# EAGLE design CCM_0011_Subrack_Backplane (EAGLE 8.6.0)

## Sheet 1 of 6: Bus Standard Definition
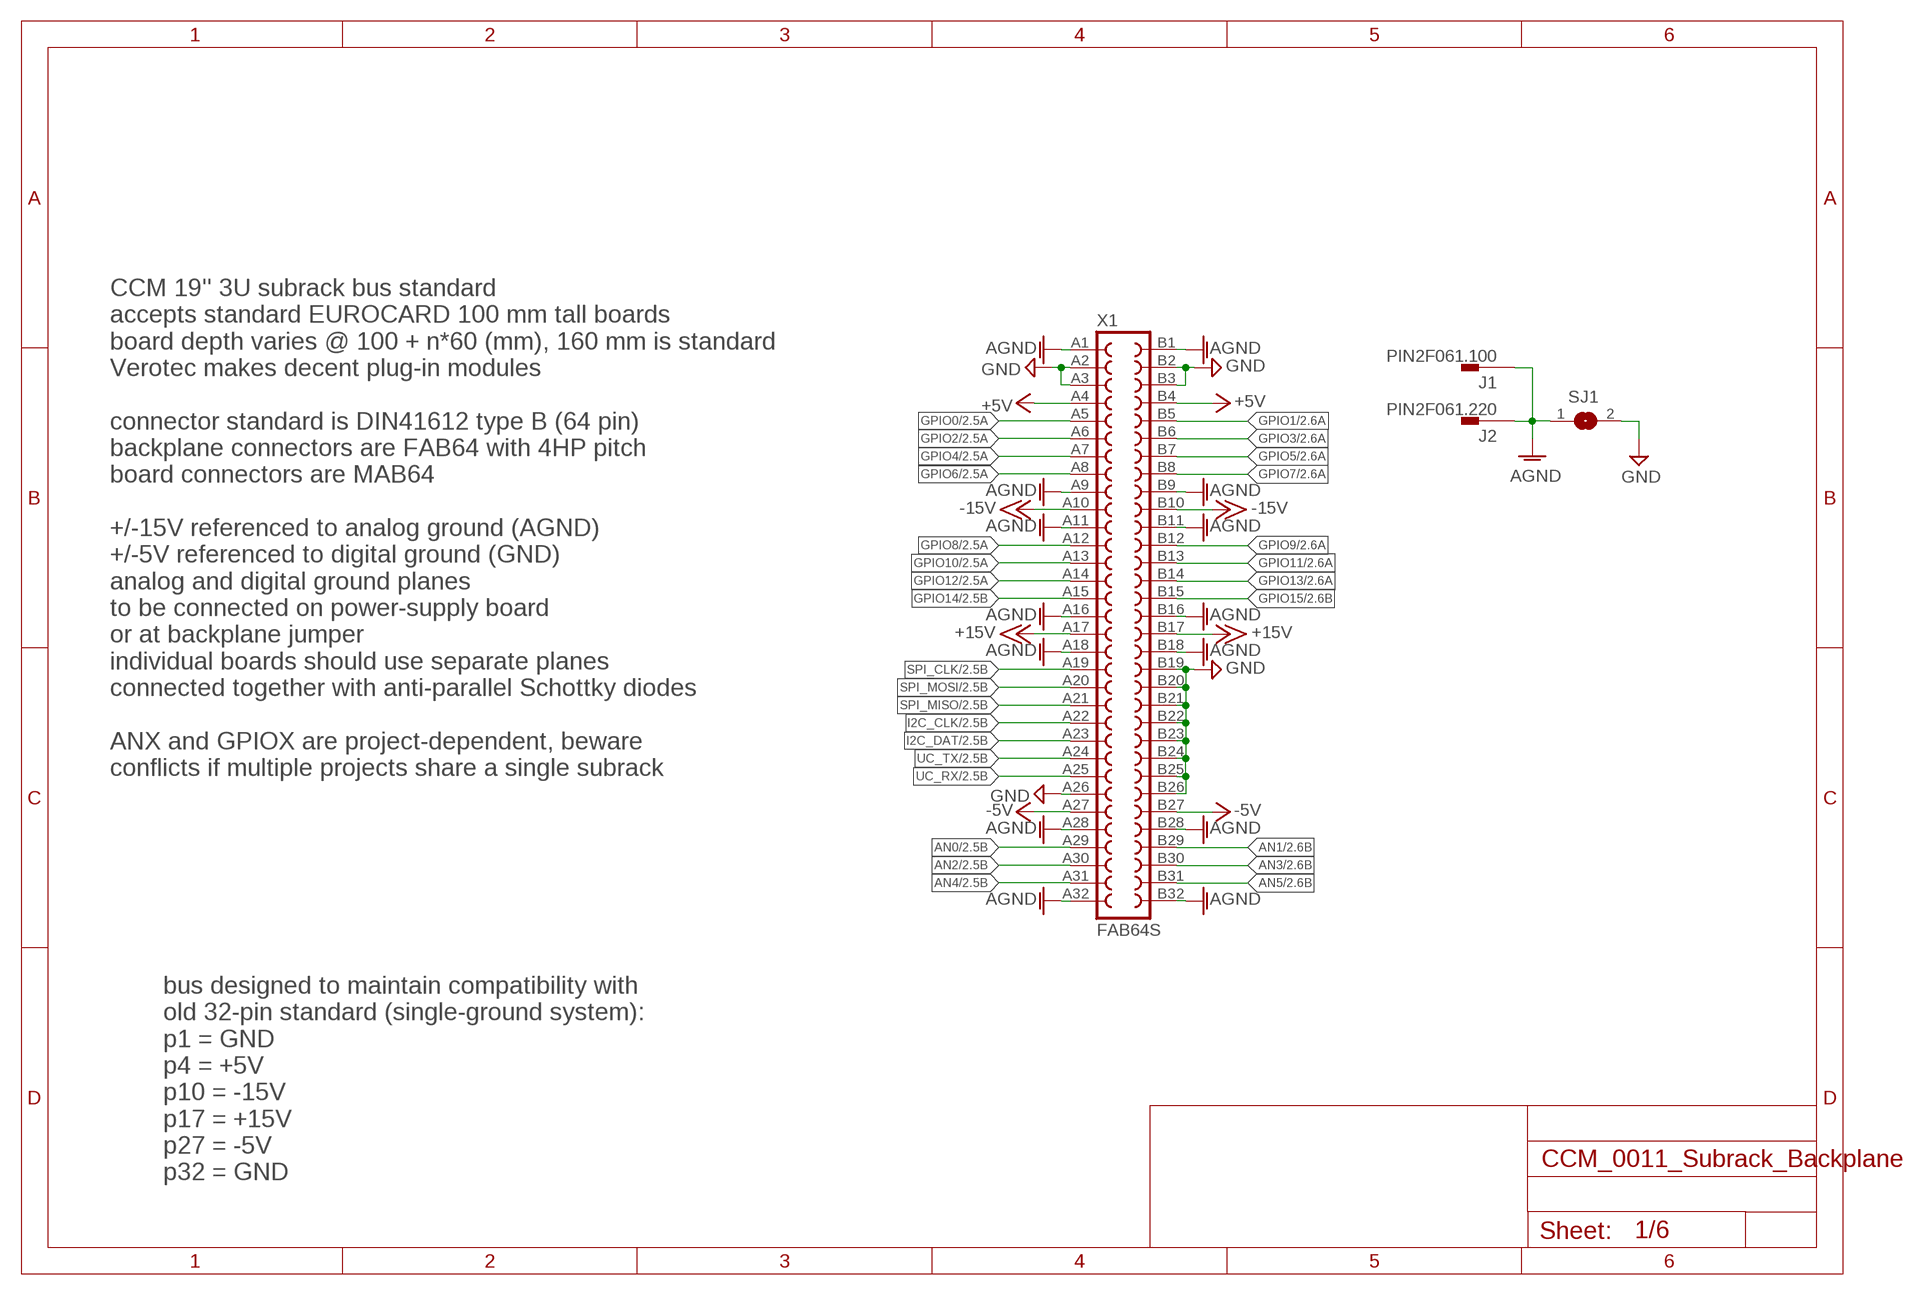
[diagram p0: schematic, sheet 1]

### Parts
J1  PIN2F061.100  [F061.100]
J2  PIN2F061.220  [F061.220]
SJ1  SJ  [SJ]
X1  FAB64S  [FAB64S]

### Nets
+5V: X1.A4 X1.B4 ; also sheet 2,3,4,5,6
+15V: X1.A17 X1.B17 ; also sheet 2,3,4,5,6
-5V: X1.A27 X1.B27 ; also sheet 2,3,4,5,6
-15V: X1.A10 X1.B10 ; also sheet 2,3,4,5,6
AGND: J1.A1 J1.A2 J2.1A J2.1B SJ1.1 X1.A1 X1.A9 X1.A11 X1.A16 X1.A18 X1.A28 X1.A32 X1.B1 X1.B9 X1.B11 X1.B16 X1.B18 X1.B28 X1.B32 ; also sheet 2,3,4,5,6
AN0: X1.A29 ; also sheet 2,3,4,5,6
AN1: X1.B29 ; also sheet 2,3,4,5,6
AN2: X1.A30 ; also sheet 2,3,4,5,6
AN3: X1.B30 ; also sheet 2,3,4,5,6
AN4: X1.A31 ; also sheet 2,3,4,5,6
AN5: X1.B31 ; also sheet 2,3,4,5,6
GND: SJ1.2 X1.A2 X1.A3 X1.A26 X1.B2 X1.B3 X1.B19 X1.B20 X1.B21 X1.B22 X1.B23 X1.B24 X1.B25 X1.B26 ; also sheet 2,3,4,5,6
GPIO0: X1.A5 ; also sheet 2,3,4,5,6
GPIO1: X1.B5 ; also sheet 2,3,4,5,6
GPIO2: X1.A6 ; also sheet 2,3,4,5,6
GPIO3: X1.B6 ; also sheet 2,3,4,5,6
GPIO4: X1.A7 ; also sheet 2,3,4,5,6
GPIO5: X1.B7 ; also sheet 2,3,4,5,6
GPIO6: X1.A8 ; also sheet 2,3,4,5,6
GPIO7: X1.B8 ; also sheet 2,3,4,5,6
GPIO8: X1.A12 ; also sheet 2,3,4,5,6
GPIO9: X1.B12 ; also sheet 2,3,4,5,6
GPIO10: X1.A13 ; also sheet 2,3,4,5,6
GPIO11: X1.B13 ; also sheet 2,3,4,5,6
GPIO12: X1.A14 ; also sheet 2,3,4,5,6
GPIO13: X1.B14 ; also sheet 2,3,4,5,6
GPIO14: X1.A15 ; also sheet 2,3,4,5,6
GPIO15: X1.B15 ; also sheet 2,3,4,5,6
I2C_CLK: X1.A22 ; also sheet 2,3,4,5,6
I2C_DAT: X1.A23 ; also sheet 2,3,4,5,6
SPI_CLK: X1.A19 ; also sheet 2,3,4,5,6
SPI_MISO: X1.A21 ; also sheet 2,3,4,5,6
SPI_MOSI: X1.A20 ; also sheet 2,3,4,5,6
UC_RX: X1.A25 ; also sheet 2,3,4,5,6
UC_TX: X1.A24 ; also sheet 2,3,4,5,6

### Notes on the sheet
- CCM 19'' 3U subrack bus standard
  accepts standard EUROCARD 100 mm tall boards
  board depth varies @ 100 + n*60 (mm), 160 mm is standard
  Verotec makes decent plug-in modules
  
  connector standard is DIN41612 type B (64 pin)
  backplane connectors are FAB64 with 4HP pitch 
  board connectors are MAB64
  
  +/-15V referenced to analog ground (AGND)
  +/-5V referenced to digital ground (GND)
  analog and digital ground planes
  to be connected on power-supply board
  or at backplane jumper
  individual boards should use separate planes
  connected together with anti-parallel Schottky diodes
  
  ANX and GPIOX are project-dependent, beware 
  conflicts if multiple projects share a single subrack
- bus designed to maintain compatibility with 
  old 32-pin standard (single-ground system):
  p1 = GND
  p4 = +5V
  p10 = -15V
  p17 = +15V
  p27 = -5V
  p32 = GND

## Sheet 2 of 6: backplane 1
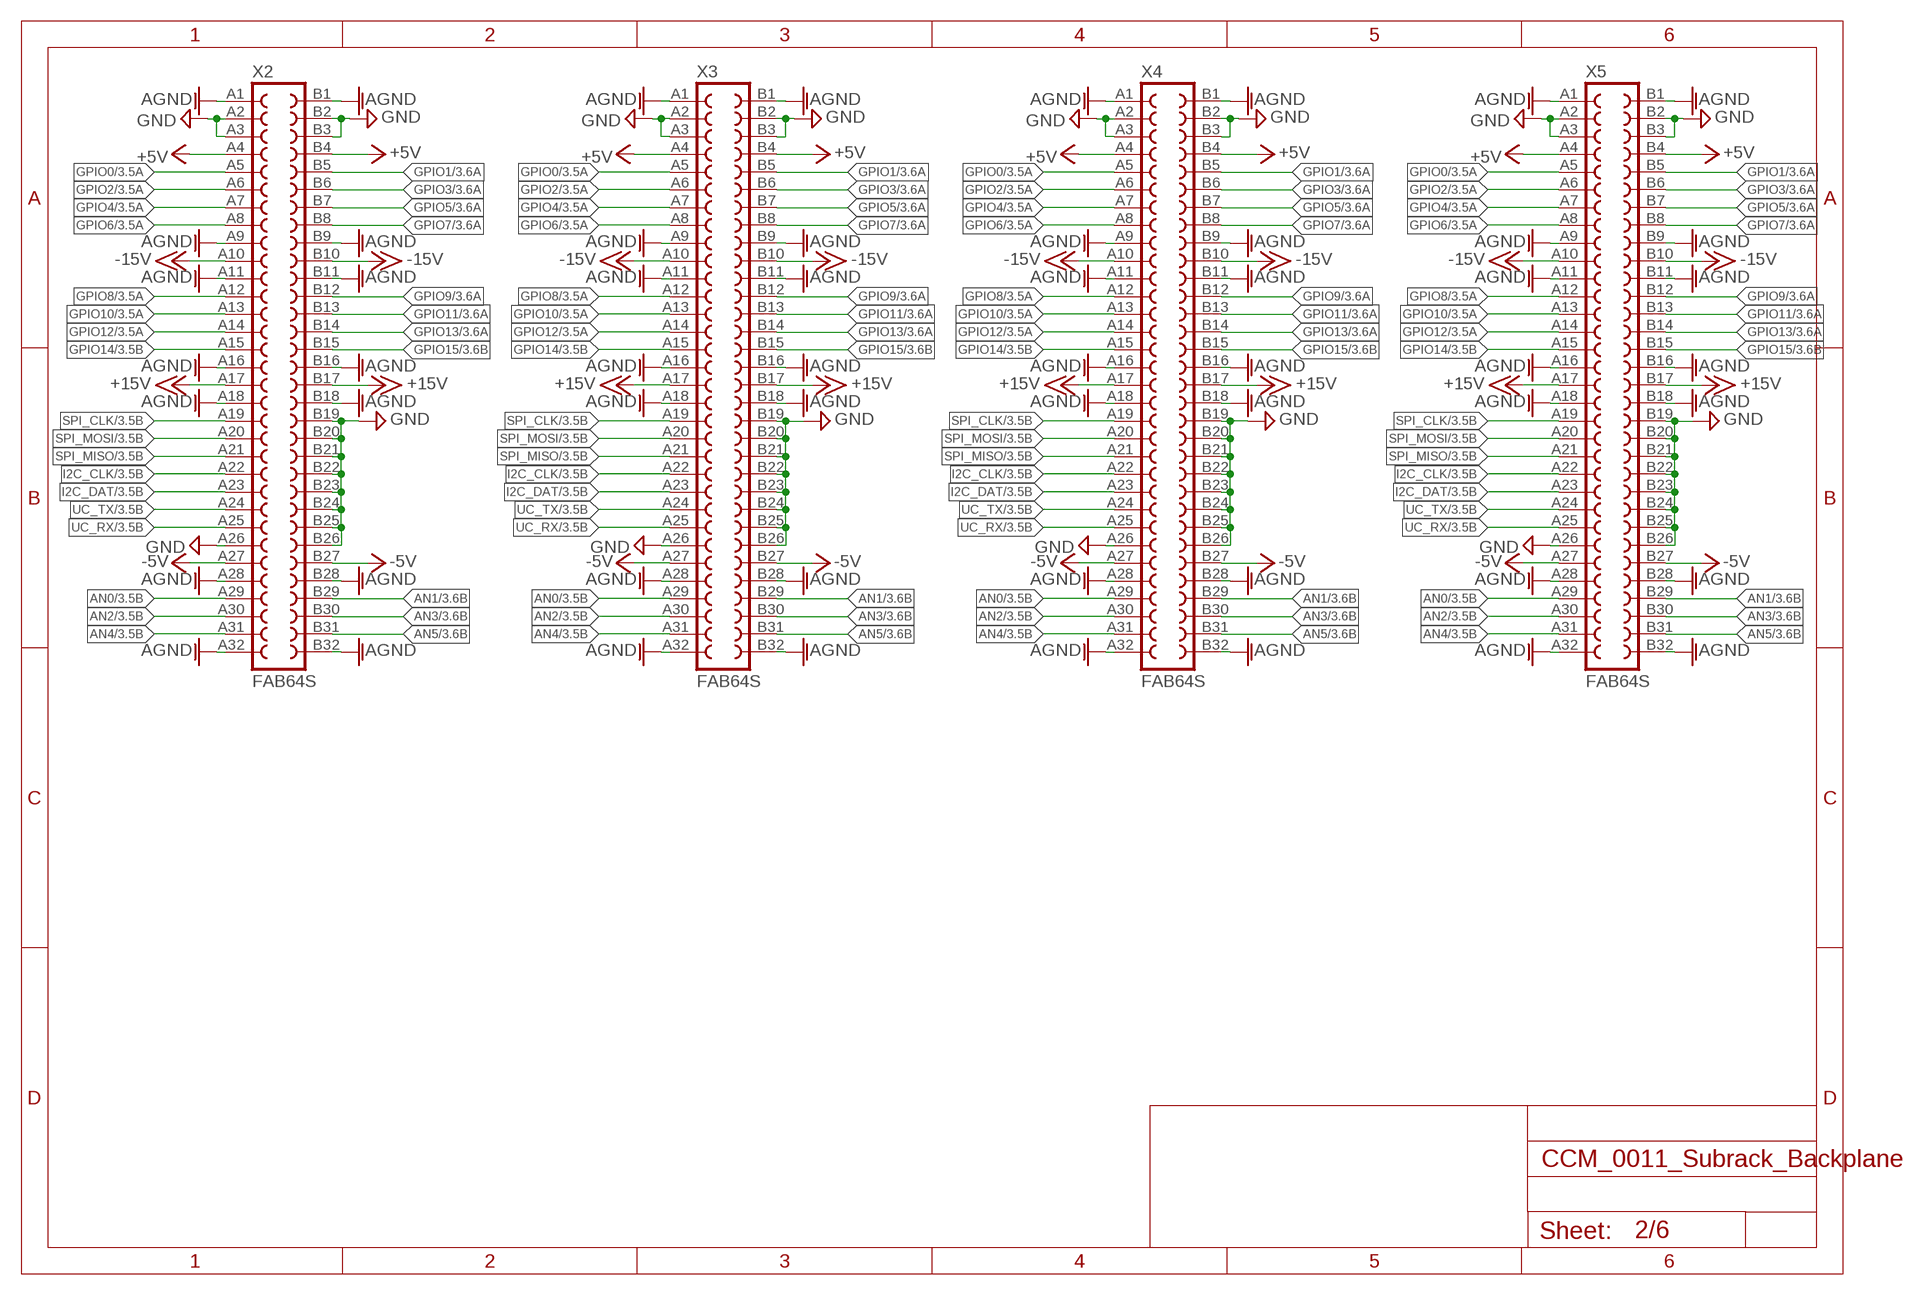
[diagram p1: schematic, sheet 2]

### Parts
X2  FAB64S  [FAB64S]
X3  FAB64S  [FAB64S]
X4  FAB64S  [FAB64S]
X5  FAB64S  [FAB64S]

### Nets
+5V: X2.A4 X2.B4 X3.A4 X3.B4 X4.A4 X4.B4 X5.A4 X5.B4 ; also sheet 1,3,4,5,6
+15V: X2.A17 X2.B17 X3.A17 X3.B17 X4.A17 X4.B17 X5.A17 X5.B17 ; also sheet 1,3,4,5,6
-5V: X2.A27 X2.B27 X3.A27 X3.B27 X4.A27 X4.B27 X5.A27 X5.B27 ; also sheet 1,3,4,5,6
-15V: X2.A10 X2.B10 X3.A10 X3.B10 X4.A10 X4.B10 X5.A10 X5.B10 ; also sheet 1,3,4,5,6
AGND: X2.A1 X2.A9 X2.A11 X2.A16 X2.A18 X2.A28 X2.A32 X2.B1 X2.B9 X2.B11 X2.B16 X2.B18 X2.B28 X2.B32 X3.A1 X3.A9 X3.A11 X3.A16 X3.A18 X3.A28 X3.A32 X3.B1 X3.B9 X3.B11 X3.B16 X3.B18 X3.B28 X3.B32 X4.A1 X4.A9 X4.A11 X4.A16 X4.A18 X4.A28 X4.A32 X4.B1 X4.B9 X4.B11 X4.B16 X4.B18 X4.B28 X4.B32 X5.A1 X5.A9 X5.A11 X5.A16 X5.A18 X5.A28 X5.A32 X5.B1 X5.B9 X5.B11 X5.B16 X5.B18 X5.B28 X5.B32 ; also sheet 1,3,4,5,6
AN0: X2.A29 X3.A29 X4.A29 X5.A29 ; also sheet 1,3,4,5,6
AN1: X2.B29 X3.B29 X4.B29 X5.B29 ; also sheet 1,3,4,5,6
AN2: X2.A30 X3.A30 X4.A30 X5.A30 ; also sheet 1,3,4,5,6
AN3: X2.B30 X3.B30 X4.B30 X5.B30 ; also sheet 1,3,4,5,6
AN4: X2.A31 X3.A31 X4.A31 X5.A31 ; also sheet 1,3,4,5,6
AN5: X2.B31 X3.B31 X4.B31 X5.B31 ; also sheet 1,3,4,5,6
GND: X2.A2 X2.A3 X2.A26 X2.B2 X2.B3 X2.B19 X2.B20 X2.B21 X2.B22 X2.B23 X2.B24 X2.B25 X2.B26 X3.A2 X3.A3 X3.A26 X3.B2 X3.B3 X3.B19 X3.B20 X3.B21 X3.B22 X3.B23 X3.B24 X3.B25 X3.B26 X4.A2 X4.A3 X4.A26 X4.B2 X4.B3 X4.B19 X4.B20 X4.B21 X4.B22 X4.B23 X4.B24 X4.B25 X4.B26 X5.A2 X5.A3 X5.A26 X5.B2 X5.B3 X5.B19 X5.B20 X5.B21 X5.B22 X5.B23 X5.B24 X5.B25 X5.B26 ; also sheet 1,3,4,5,6
GPIO0: X2.A5 X3.A5 X4.A5 X5.A5 ; also sheet 1,3,4,5,6
GPIO1: X2.B5 X3.B5 X4.B5 X5.B5 ; also sheet 1,3,4,5,6
GPIO2: X2.A6 X3.A6 X4.A6 X5.A6 ; also sheet 1,3,4,5,6
GPIO3: X2.B6 X3.B6 X4.B6 X5.B6 ; also sheet 1,3,4,5,6
GPIO4: X2.A7 X3.A7 X4.A7 X5.A7 ; also sheet 1,3,4,5,6
GPIO5: X2.B7 X3.B7 X4.B7 X5.B7 ; also sheet 1,3,4,5,6
GPIO6: X2.A8 X3.A8 X4.A8 X5.A8 ; also sheet 1,3,4,5,6
GPIO7: X2.B8 X3.B8 X4.B8 X5.B8 ; also sheet 1,3,4,5,6
GPIO8: X2.A12 X3.A12 X4.A12 X5.A12 ; also sheet 1,3,4,5,6
GPIO9: X2.B12 X3.B12 X4.B12 X5.B12 ; also sheet 1,3,4,5,6
GPIO10: X2.A13 X3.A13 X4.A13 X5.A13 ; also sheet 1,3,4,5,6
GPIO11: X2.B13 X3.B13 X4.B13 X5.B13 ; also sheet 1,3,4,5,6
GPIO12: X2.A14 X3.A14 X4.A14 X5.A14 ; also sheet 1,3,4,5,6
GPIO13: X2.B14 X3.B14 X4.B14 X5.B14 ; also sheet 1,3,4,5,6
GPIO14: X2.A15 X3.A15 X4.A15 X5.A15 ; also sheet 1,3,4,5,6
GPIO15: X2.B15 X3.B15 X4.B15 X5.B15 ; also sheet 1,3,4,5,6
I2C_CLK: X2.A22 X3.A22 X4.A22 X5.A22 ; also sheet 1,3,4,5,6
I2C_DAT: X2.A23 X3.A23 X4.A23 X5.A23 ; also sheet 1,3,4,5,6
SPI_CLK: X2.A19 X3.A19 X4.A19 X5.A19 ; also sheet 1,3,4,5,6
SPI_MISO: X2.A21 X3.A21 X4.A21 X5.A21 ; also sheet 1,3,4,5,6
SPI_MOSI: X2.A20 X3.A20 X4.A20 X5.A20 ; also sheet 1,3,4,5,6
UC_RX: X2.A25 X3.A25 X4.A25 X5.A25 ; also sheet 1,3,4,5,6
UC_TX: X2.A24 X3.A24 X4.A24 X5.A24 ; also sheet 1,3,4,5,6

## Sheet 3 of 6: backplane 2
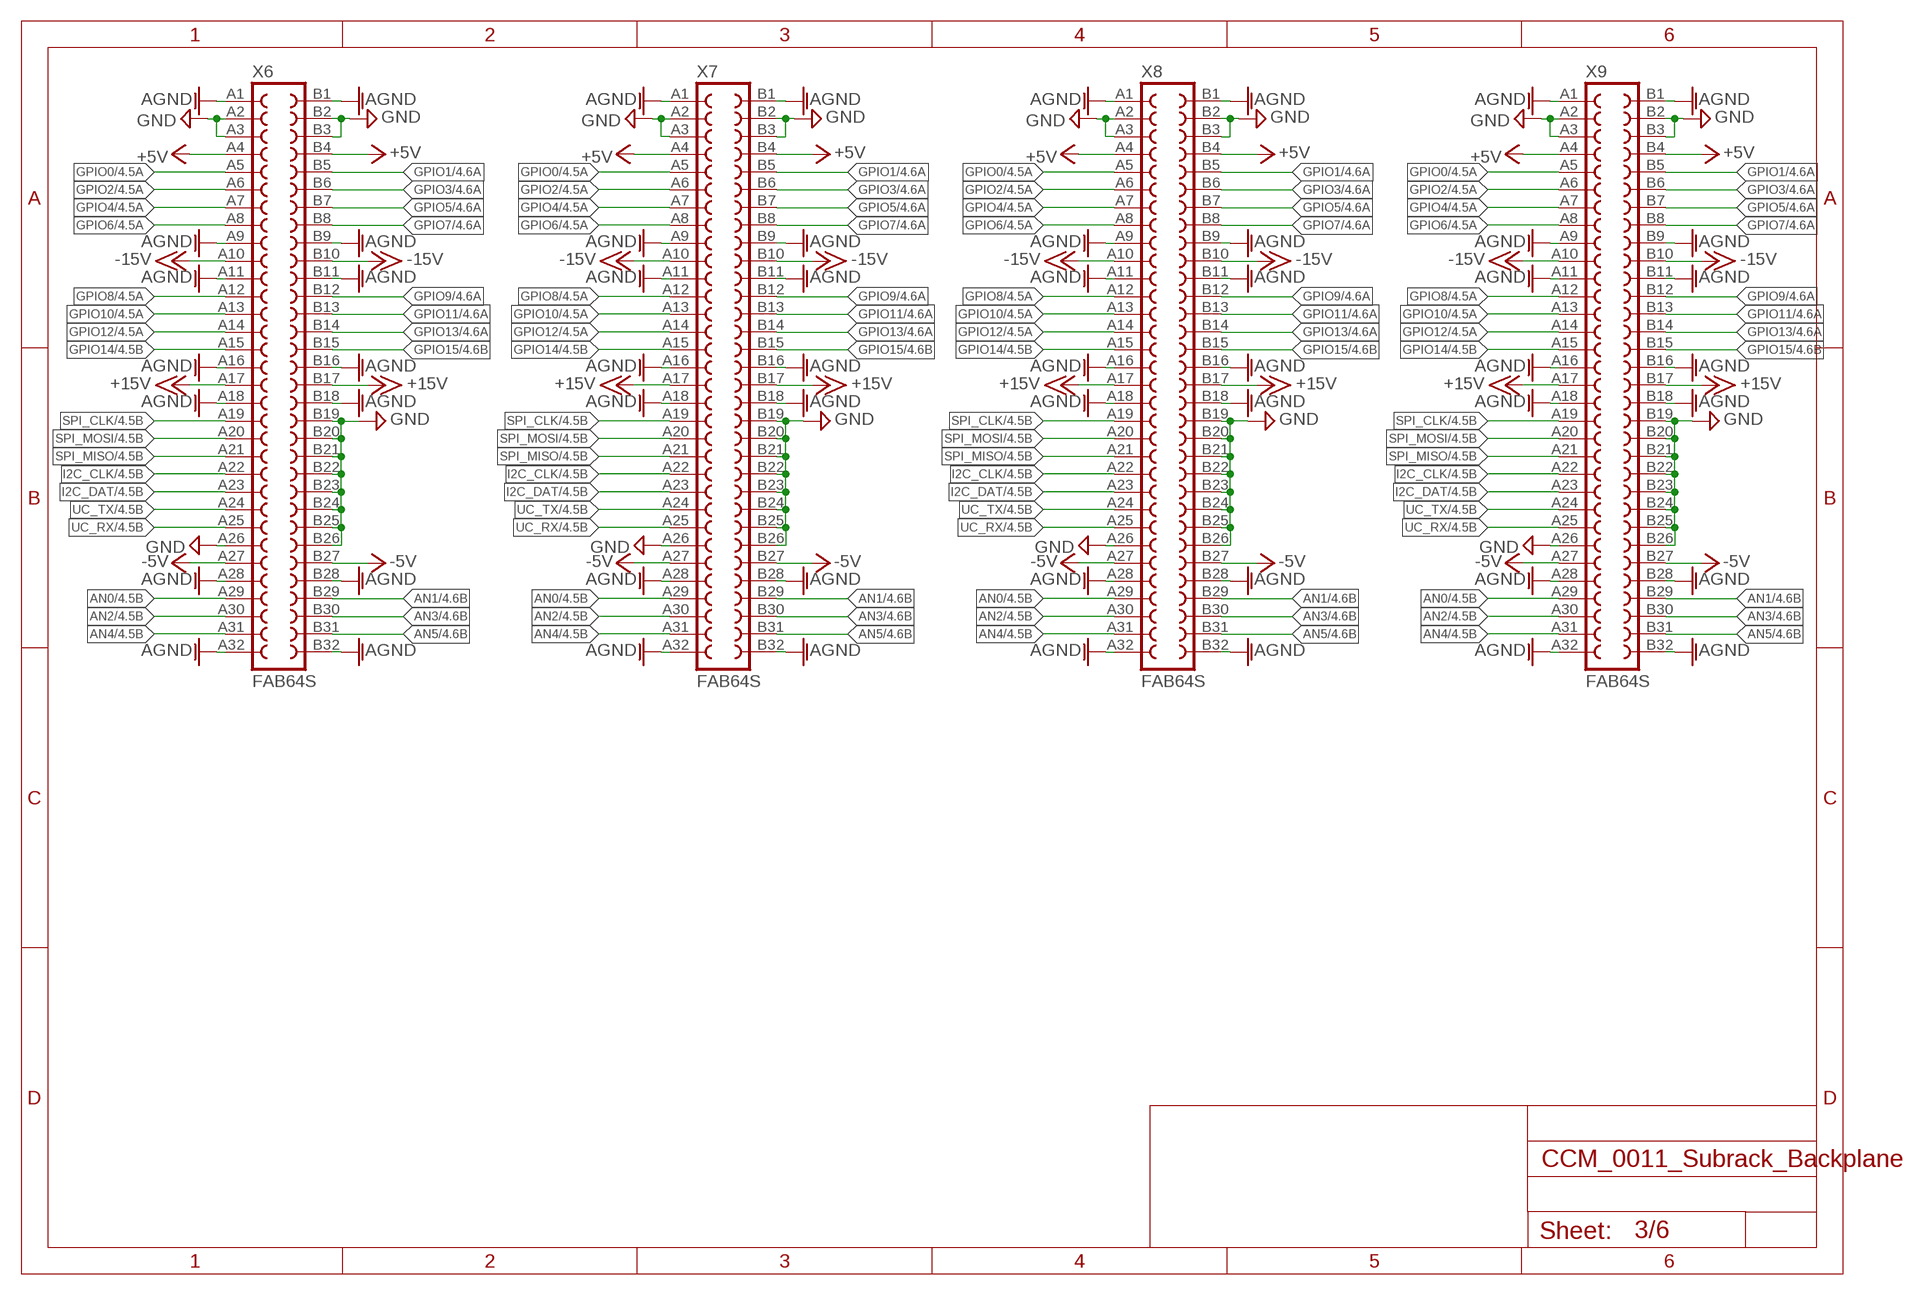
[diagram p2: schematic, sheet 3]

### Parts
X6  FAB64S  [FAB64S]
X7  FAB64S  [FAB64S]
X8  FAB64S  [FAB64S]
X9  FAB64S  [FAB64S]

### Nets
+5V: X6.A4 X6.B4 X7.A4 X7.B4 X8.A4 X8.B4 X9.A4 X9.B4 ; also sheet 1,2,4,5,6
+15V: X6.A17 X6.B17 X7.A17 X7.B17 X8.A17 X8.B17 X9.A17 X9.B17 ; also sheet 1,2,4,5,6
-5V: X6.A27 X6.B27 X7.A27 X7.B27 X8.A27 X8.B27 X9.A27 X9.B27 ; also sheet 1,2,4,5,6
-15V: X6.A10 X6.B10 X7.A10 X7.B10 X8.A10 X8.B10 X9.A10 X9.B10 ; also sheet 1,2,4,5,6
AGND: X6.A1 X6.A9 X6.A11 X6.A16 X6.A18 X6.A28 X6.A32 X6.B1 X6.B9 X6.B11 X6.B16 X6.B18 X6.B28 X6.B32 X7.A1 X7.A9 X7.A11 X7.A16 X7.A18 X7.A28 X7.A32 X7.B1 X7.B9 X7.B11 X7.B16 X7.B18 X7.B28 X7.B32 X8.A1 X8.A9 X8.A11 X8.A16 X8.A18 X8.A28 X8.A32 X8.B1 X8.B9 X8.B11 X8.B16 X8.B18 X8.B28 X8.B32 X9.A1 X9.A9 X9.A11 X9.A16 X9.A18 X9.A28 X9.A32 X9.B1 X9.B9 X9.B11 X9.B16 X9.B18 X9.B28 X9.B32 ; also sheet 1,2,4,5,6
AN0: X6.A29 X7.A29 X8.A29 X9.A29 ; also sheet 1,2,4,5,6
AN1: X6.B29 X7.B29 X8.B29 X9.B29 ; also sheet 1,2,4,5,6
AN2: X6.A30 X7.A30 X8.A30 X9.A30 ; also sheet 1,2,4,5,6
AN3: X6.B30 X7.B30 X8.B30 X9.B30 ; also sheet 1,2,4,5,6
AN4: X6.A31 X7.A31 X8.A31 X9.A31 ; also sheet 1,2,4,5,6
AN5: X6.B31 X7.B31 X8.B31 X9.B31 ; also sheet 1,2,4,5,6
GND: X6.A2 X6.A3 X6.A26 X6.B2 X6.B3 X6.B19 X6.B20 X6.B21 X6.B22 X6.B23 X6.B24 X6.B25 X6.B26 X7.A2 X7.A3 X7.A26 X7.B2 X7.B3 X7.B19 X7.B20 X7.B21 X7.B22 X7.B23 X7.B24 X7.B25 X7.B26 X8.A2 X8.A3 X8.A26 X8.B2 X8.B3 X8.B19 X8.B20 X8.B21 X8.B22 X8.B23 X8.B24 X8.B25 X8.B26 X9.A2 X9.A3 X9.A26 X9.B2 X9.B3 X9.B19 X9.B20 X9.B21 X9.B22 X9.B23 X9.B24 X9.B25 X9.B26 ; also sheet 1,2,4,5,6
GPIO0: X6.A5 X7.A5 X8.A5 X9.A5 ; also sheet 1,2,4,5,6
GPIO1: X6.B5 X7.B5 X8.B5 X9.B5 ; also sheet 1,2,4,5,6
GPIO2: X6.A6 X7.A6 X8.A6 X9.A6 ; also sheet 1,2,4,5,6
GPIO3: X6.B6 X7.B6 X8.B6 X9.B6 ; also sheet 1,2,4,5,6
GPIO4: X6.A7 X7.A7 X8.A7 X9.A7 ; also sheet 1,2,4,5,6
GPIO5: X6.B7 X7.B7 X8.B7 X9.B7 ; also sheet 1,2,4,5,6
GPIO6: X6.A8 X7.A8 X8.A8 X9.A8 ; also sheet 1,2,4,5,6
GPIO7: X6.B8 X7.B8 X8.B8 X9.B8 ; also sheet 1,2,4,5,6
GPIO8: X6.A12 X7.A12 X8.A12 X9.A12 ; also sheet 1,2,4,5,6
GPIO9: X6.B12 X7.B12 X8.B12 X9.B12 ; also sheet 1,2,4,5,6
GPIO10: X6.A13 X7.A13 X8.A13 X9.A13 ; also sheet 1,2,4,5,6
GPIO11: X6.B13 X7.B13 X8.B13 X9.B13 ; also sheet 1,2,4,5,6
GPIO12: X6.A14 X7.A14 X8.A14 X9.A14 ; also sheet 1,2,4,5,6
GPIO13: X6.B14 X7.B14 X8.B14 X9.B14 ; also sheet 1,2,4,5,6
GPIO14: X6.A15 X7.A15 X8.A15 X9.A15 ; also sheet 1,2,4,5,6
GPIO15: X6.B15 X7.B15 X8.B15 X9.B15 ; also sheet 1,2,4,5,6
I2C_CLK: X6.A22 X7.A22 X8.A22 X9.A22 ; also sheet 1,2,4,5,6
I2C_DAT: X6.A23 X7.A23 X8.A23 X9.A23 ; also sheet 1,2,4,5,6
SPI_CLK: X6.A19 X7.A19 X8.A19 X9.A19 ; also sheet 1,2,4,5,6
SPI_MISO: X6.A21 X7.A21 X8.A21 X9.A21 ; also sheet 1,2,4,5,6
SPI_MOSI: X6.A20 X7.A20 X8.A20 X9.A20 ; also sheet 1,2,4,5,6
UC_RX: X6.A25 X7.A25 X8.A25 X9.A25 ; also sheet 1,2,4,5,6
UC_TX: X6.A24 X7.A24 X8.A24 X9.A24 ; also sheet 1,2,4,5,6

## Sheet 4 of 6: backplane 3
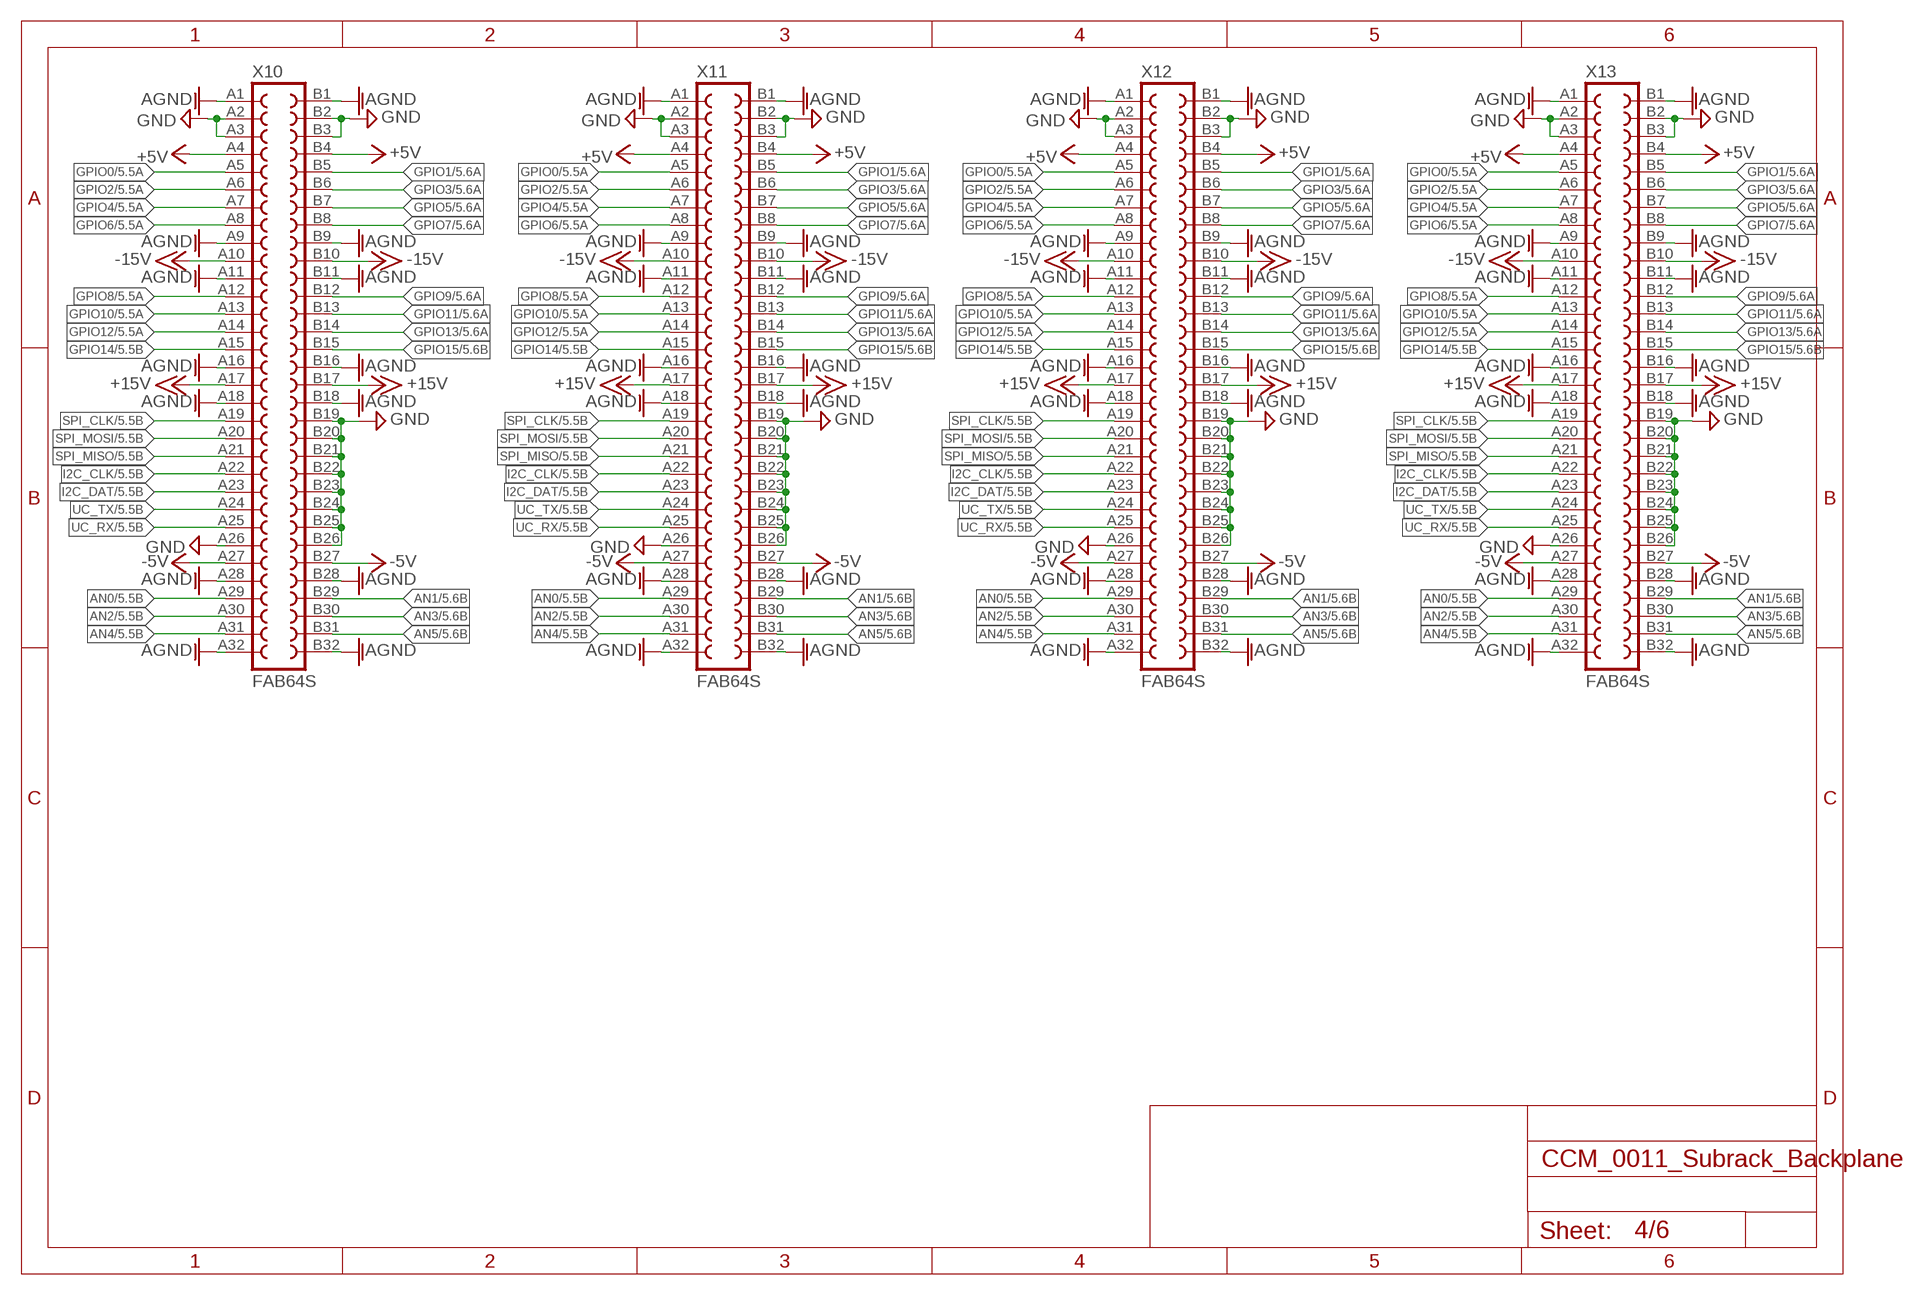
[diagram p3: schematic, sheet 4]

### Parts
X10  FAB64S  [FAB64S]
X11  FAB64S  [FAB64S]
X12  FAB64S  [FAB64S]
X13  FAB64S  [FAB64S]

### Nets
+5V: X10.A4 X10.B4 X11.A4 X11.B4 X12.A4 X12.B4 X13.A4 X13.B4 ; also sheet 1,2,3,5,6
+15V: X10.A17 X10.B17 X11.A17 X11.B17 X12.A17 X12.B17 X13.A17 X13.B17 ; also sheet 1,2,3,5,6
-5V: X10.A27 X10.B27 X11.A27 X11.B27 X12.A27 X12.B27 X13.A27 X13.B27 ; also sheet 1,2,3,5,6
-15V: X10.A10 X10.B10 X11.A10 X11.B10 X12.A10 X12.B10 X13.A10 X13.B10 ; also sheet 1,2,3,5,6
AGND: X10.A1 X10.A9 X10.A11 X10.A16 X10.A18 X10.A28 X10.A32 X10.B1 X10.B9 X10.B11 X10.B16 X10.B18 X10.B28 X10.B32 X11.A1 X11.A9 X11.A11 X11.A16 X11.A18 X11.A28 X11.A32 X11.B1 X11.B9 X11.B11 X11.B16 X11.B18 X11.B28 X11.B32 X12.A1 X12.A9 X12.A11 X12.A16 X12.A18 X12.A28 X12.A32 X12.B1 X12.B9 X12.B11 X12.B16 X12.B18 X12.B28 X12.B32 X13.A1 X13.A9 X13.A11 X13.A16 X13.A18 X13.A28 X13.A32 X13.B1 X13.B9 X13.B11 X13.B16 X13.B18 X13.B28 X13.B32 ; also sheet 1,2,3,5,6
AN0: X10.A29 X11.A29 X12.A29 X13.A29 ; also sheet 1,2,3,5,6
AN1: X10.B29 X11.B29 X12.B29 X13.B29 ; also sheet 1,2,3,5,6
AN2: X10.A30 X11.A30 X12.A30 X13.A30 ; also sheet 1,2,3,5,6
AN3: X10.B30 X11.B30 X12.B30 X13.B30 ; also sheet 1,2,3,5,6
AN4: X10.A31 X11.A31 X12.A31 X13.A31 ; also sheet 1,2,3,5,6
AN5: X10.B31 X11.B31 X12.B31 X13.B31 ; also sheet 1,2,3,5,6
GND: X10.A2 X10.A3 X10.A26 X10.B2 X10.B3 X10.B19 X10.B20 X10.B21 X10.B22 X10.B23 X10.B24 X10.B25 X10.B26 X11.A2 X11.A3 X11.A26 X11.B2 X11.B3 X11.B19 X11.B20 X11.B21 X11.B22 X11.B23 X11.B24 X11.B25 X11.B26 X12.A2 X12.A3 X12.A26 X12.B2 X12.B3 X12.B19 X12.B20 X12.B21 X12.B22 X12.B23 X12.B24 X12.B25 X12.B26 X13.A2 X13.A3 X13.A26 X13.B2 X13.B3 X13.B19 X13.B20 X13.B21 X13.B22 X13.B23 X13.B24 X13.B25 X13.B26 ; also sheet 1,2,3,5,6
GPIO0: X10.A5 X11.A5 X12.A5 X13.A5 ; also sheet 1,2,3,5,6
GPIO1: X10.B5 X11.B5 X12.B5 X13.B5 ; also sheet 1,2,3,5,6
GPIO2: X10.A6 X11.A6 X12.A6 X13.A6 ; also sheet 1,2,3,5,6
GPIO3: X10.B6 X11.B6 X12.B6 X13.B6 ; also sheet 1,2,3,5,6
GPIO4: X10.A7 X11.A7 X12.A7 X13.A7 ; also sheet 1,2,3,5,6
GPIO5: X10.B7 X11.B7 X12.B7 X13.B7 ; also sheet 1,2,3,5,6
GPIO6: X10.A8 X11.A8 X12.A8 X13.A8 ; also sheet 1,2,3,5,6
GPIO7: X10.B8 X11.B8 X12.B8 X13.B8 ; also sheet 1,2,3,5,6
GPIO8: X10.A12 X11.A12 X12.A12 X13.A12 ; also sheet 1,2,3,5,6
GPIO9: X10.B12 X11.B12 X12.B12 X13.B12 ; also sheet 1,2,3,5,6
GPIO10: X10.A13 X11.A13 X12.A13 X13.A13 ; also sheet 1,2,3,5,6
GPIO11: X10.B13 X11.B13 X12.B13 X13.B13 ; also sheet 1,2,3,5,6
GPIO12: X10.A14 X11.A14 X12.A14 X13.A14 ; also sheet 1,2,3,5,6
GPIO13: X10.B14 X11.B14 X12.B14 X13.B14 ; also sheet 1,2,3,5,6
GPIO14: X10.A15 X11.A15 X12.A15 X13.A15 ; also sheet 1,2,3,5,6
GPIO15: X10.B15 X11.B15 X12.B15 X13.B15 ; also sheet 1,2,3,5,6
I2C_CLK: X10.A22 X11.A22 X12.A22 X13.A22 ; also sheet 1,2,3,5,6
I2C_DAT: X10.A23 X11.A23 X12.A23 X13.A23 ; also sheet 1,2,3,5,6
SPI_CLK: X10.A19 X11.A19 X12.A19 X13.A19 ; also sheet 1,2,3,5,6
SPI_MISO: X10.A21 X11.A21 X12.A21 X13.A21 ; also sheet 1,2,3,5,6
SPI_MOSI: X10.A20 X11.A20 X12.A20 X13.A20 ; also sheet 1,2,3,5,6
UC_RX: X10.A25 X11.A25 X12.A25 X13.A25 ; also sheet 1,2,3,5,6
UC_TX: X10.A24 X11.A24 X12.A24 X13.A24 ; also sheet 1,2,3,5,6

## Sheet 5 of 6: backplane 4
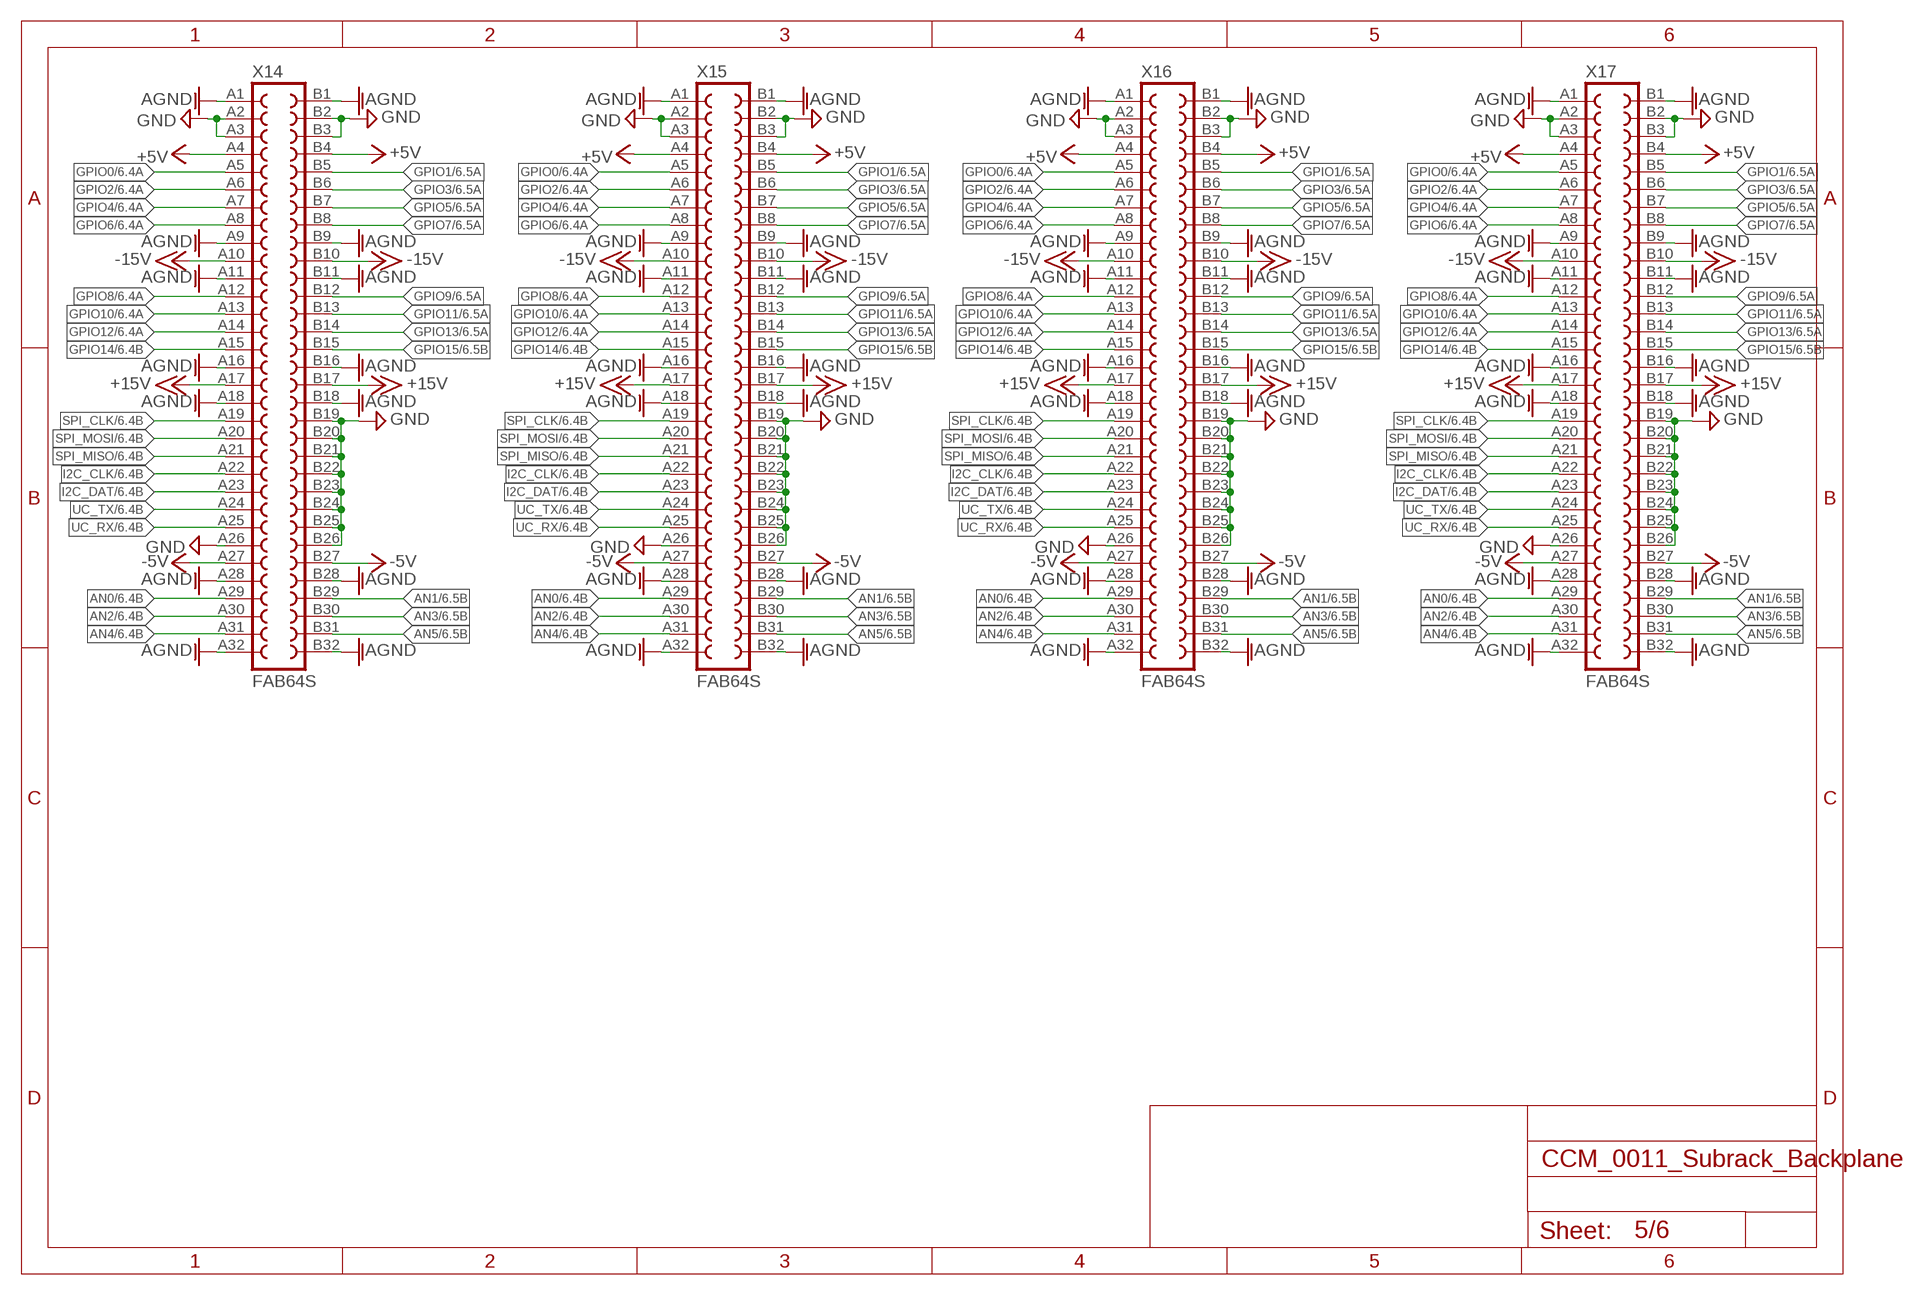
[diagram p4: schematic, sheet 5]

### Parts
X14  FAB64S  [FAB64S]
X15  FAB64S  [FAB64S]
X16  FAB64S  [FAB64S]
X17  FAB64S  [FAB64S]

### Nets
+5V: X14.A4 X14.B4 X15.A4 X15.B4 X16.A4 X16.B4 X17.A4 X17.B4 ; also sheet 1,2,3,4,6
+15V: X14.A17 X14.B17 X15.A17 X15.B17 X16.A17 X16.B17 X17.A17 X17.B17 ; also sheet 1,2,3,4,6
-5V: X14.A27 X14.B27 X15.A27 X15.B27 X16.A27 X16.B27 X17.A27 X17.B27 ; also sheet 1,2,3,4,6
-15V: X14.A10 X14.B10 X15.A10 X15.B10 X16.A10 X16.B10 X17.A10 X17.B10 ; also sheet 1,2,3,4,6
AGND: X14.A1 X14.A9 X14.A11 X14.A16 X14.A18 X14.A28 X14.A32 X14.B1 X14.B9 X14.B11 X14.B16 X14.B18 X14.B28 X14.B32 X15.A1 X15.A9 X15.A11 X15.A16 X15.A18 X15.A28 X15.A32 X15.B1 X15.B9 X15.B11 X15.B16 X15.B18 X15.B28 X15.B32 X16.A1 X16.A9 X16.A11 X16.A16 X16.A18 X16.A28 X16.A32 X16.B1 X16.B9 X16.B11 X16.B16 X16.B18 X16.B28 X16.B32 X17.A1 X17.A9 X17.A11 X17.A16 X17.A18 X17.A28 X17.A32 X17.B1 X17.B9 X17.B11 X17.B16 X17.B18 X17.B28 X17.B32 ; also sheet 1,2,3,4,6
AN0: X14.A29 X15.A29 X16.A29 X17.A29 ; also sheet 1,2,3,4,6
AN1: X14.B29 X15.B29 X16.B29 X17.B29 ; also sheet 1,2,3,4,6
AN2: X14.A30 X15.A30 X16.A30 X17.A30 ; also sheet 1,2,3,4,6
AN3: X14.B30 X15.B30 X16.B30 X17.B30 ; also sheet 1,2,3,4,6
AN4: X14.A31 X15.A31 X16.A31 X17.A31 ; also sheet 1,2,3,4,6
AN5: X14.B31 X15.B31 X16.B31 X17.B31 ; also sheet 1,2,3,4,6
GND: X14.A2 X14.A3 X14.A26 X14.B2 X14.B3 X14.B19 X14.B20 X14.B21 X14.B22 X14.B23 X14.B24 X14.B25 X14.B26 X15.A2 X15.A3 X15.A26 X15.B2 X15.B3 X15.B19 X15.B20 X15.B21 X15.B22 X15.B23 X15.B24 X15.B25 X15.B26 X16.A2 X16.A3 X16.A26 X16.B2 X16.B3 X16.B19 X16.B20 X16.B21 X16.B22 X16.B23 X16.B24 X16.B25 X16.B26 X17.A2 X17.A3 X17.A26 X17.B2 X17.B3 X17.B19 X17.B20 X17.B21 X17.B22 X17.B23 X17.B24 X17.B25 X17.B26 ; also sheet 1,2,3,4,6
GPIO0: X14.A5 X15.A5 X16.A5 X17.A5 ; also sheet 1,2,3,4,6
GPIO1: X14.B5 X15.B5 X16.B5 X17.B5 ; also sheet 1,2,3,4,6
GPIO2: X14.A6 X15.A6 X16.A6 X17.A6 ; also sheet 1,2,3,4,6
GPIO3: X14.B6 X15.B6 X16.B6 X17.B6 ; also sheet 1,2,3,4,6
GPIO4: X14.A7 X15.A7 X16.A7 X17.A7 ; also sheet 1,2,3,4,6
GPIO5: X14.B7 X15.B7 X16.B7 X17.B7 ; also sheet 1,2,3,4,6
GPIO6: X14.A8 X15.A8 X16.A8 X17.A8 ; also sheet 1,2,3,4,6
GPIO7: X14.B8 X15.B8 X16.B8 X17.B8 ; also sheet 1,2,3,4,6
GPIO8: X14.A12 X15.A12 X16.A12 X17.A12 ; also sheet 1,2,3,4,6
GPIO9: X14.B12 X15.B12 X16.B12 X17.B12 ; also sheet 1,2,3,4,6
GPIO10: X14.A13 X15.A13 X16.A13 X17.A13 ; also sheet 1,2,3,4,6
GPIO11: X14.B13 X15.B13 X16.B13 X17.B13 ; also sheet 1,2,3,4,6
GPIO12: X14.A14 X15.A14 X16.A14 X17.A14 ; also sheet 1,2,3,4,6
GPIO13: X14.B14 X15.B14 X16.B14 X17.B14 ; also sheet 1,2,3,4,6
GPIO14: X14.A15 X15.A15 X16.A15 X17.A15 ; also sheet 1,2,3,4,6
GPIO15: X14.B15 X15.B15 X16.B15 X17.B15 ; also sheet 1,2,3,4,6
I2C_CLK: X14.A22 X15.A22 X16.A22 X17.A22 ; also sheet 1,2,3,4,6
I2C_DAT: X14.A23 X15.A23 X16.A23 X17.A23 ; also sheet 1,2,3,4,6
SPI_CLK: X14.A19 X15.A19 X16.A19 X17.A19 ; also sheet 1,2,3,4,6
SPI_MISO: X14.A21 X15.A21 X16.A21 X17.A21 ; also sheet 1,2,3,4,6
SPI_MOSI: X14.A20 X15.A20 X16.A20 X17.A20 ; also sheet 1,2,3,4,6
UC_RX: X14.A25 X15.A25 X16.A25 X17.A25 ; also sheet 1,2,3,4,6
UC_TX: X14.A24 X15.A24 X16.A24 X17.A24 ; also sheet 1,2,3,4,6

## Sheet 6 of 6: backplane 5
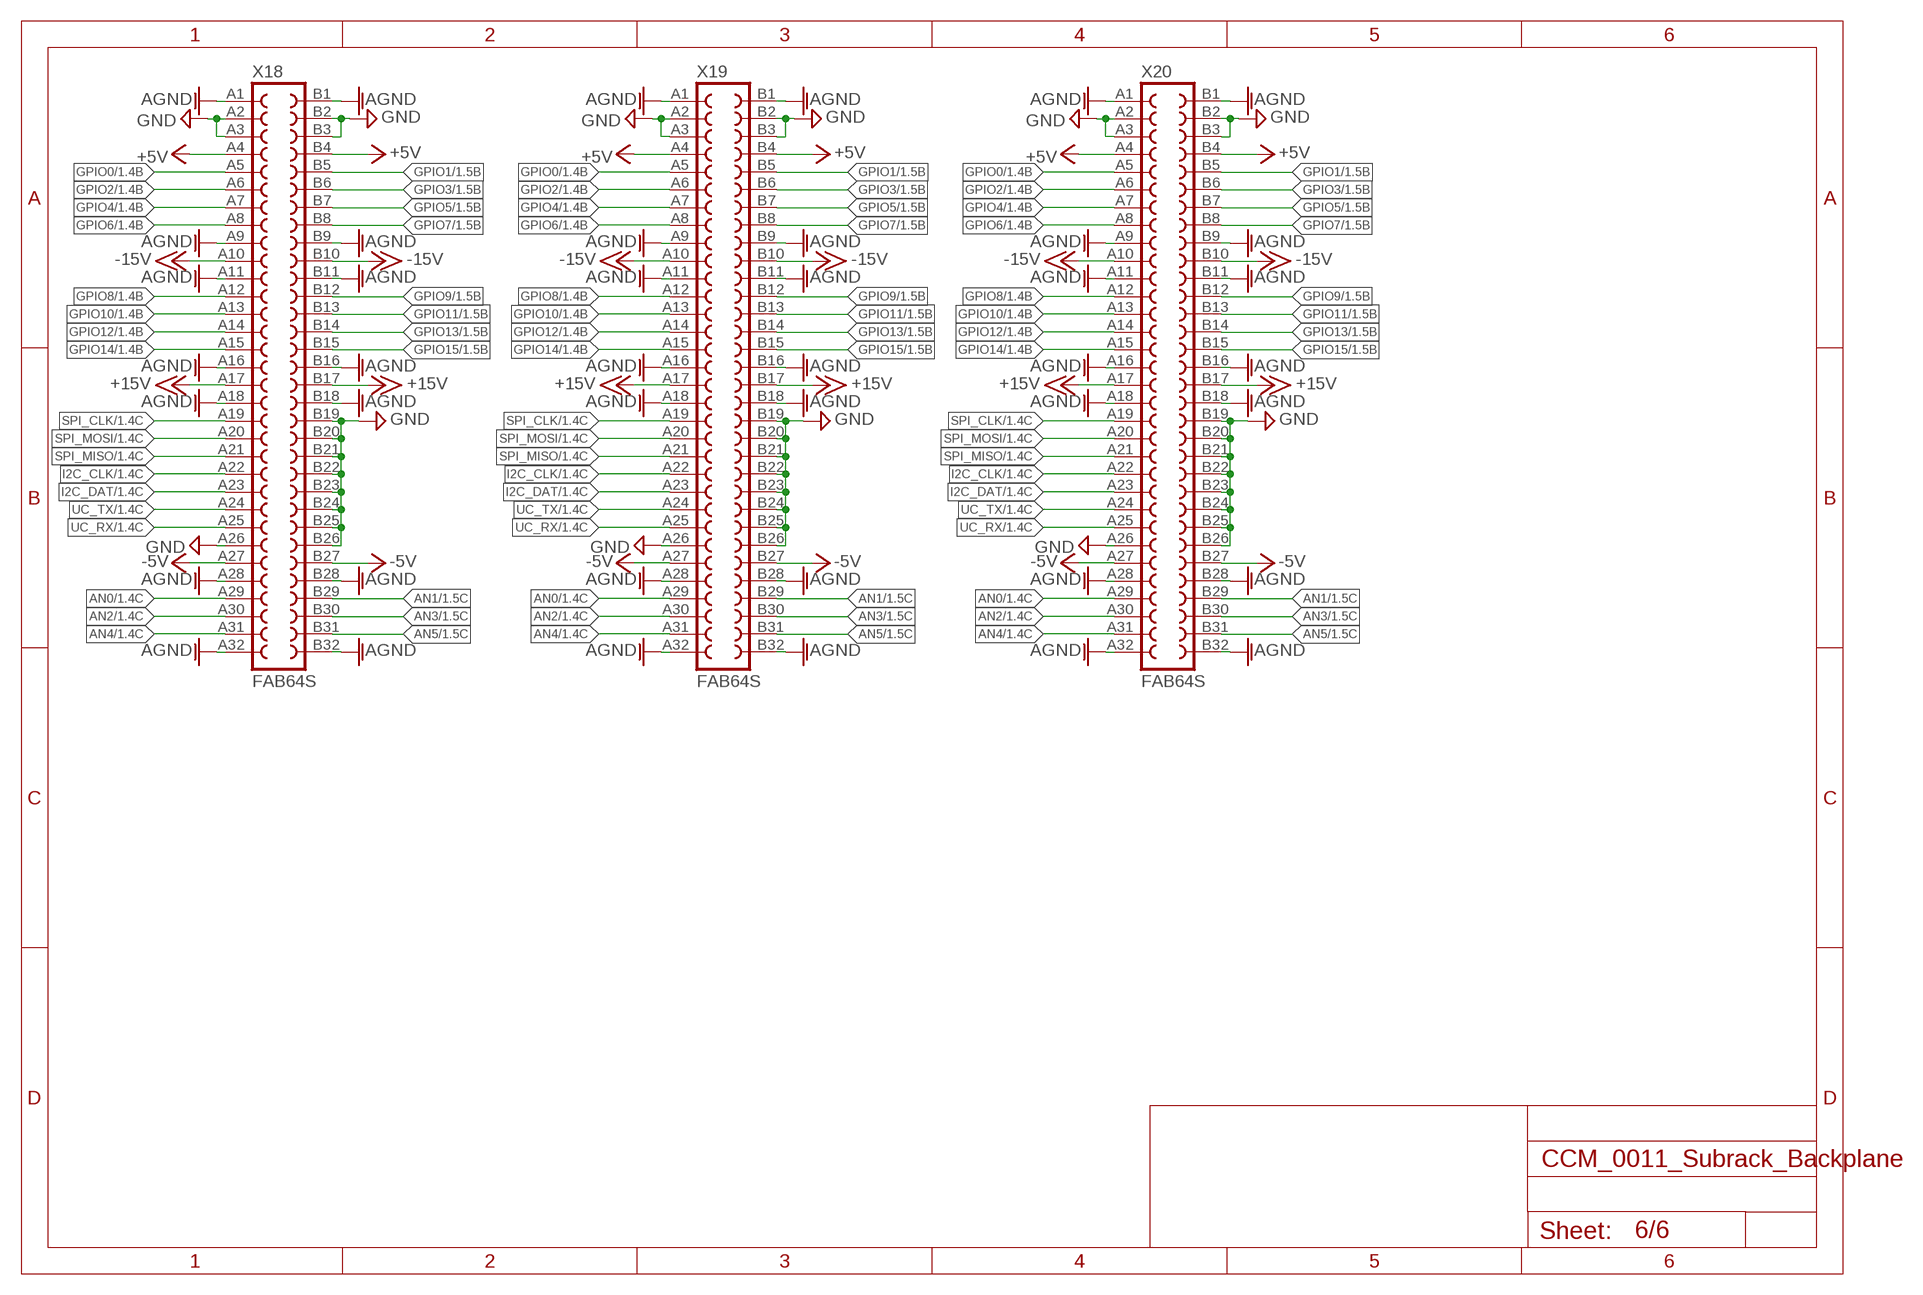
[diagram p5: schematic, sheet 6]

### Parts
X18  FAB64S  [FAB64S]
X19  FAB64S  [FAB64S]
X20  FAB64S  [FAB64S]

### Nets
+5V: X18.A4 X18.B4 X19.A4 X19.B4 X20.A4 X20.B4 ; also sheet 1,2,3,4,5
+15V: X18.A17 X18.B17 X19.A17 X19.B17 X20.A17 X20.B17 ; also sheet 1,2,3,4,5
-5V: X18.A27 X18.B27 X19.A27 X19.B27 X20.A27 X20.B27 ; also sheet 1,2,3,4,5
-15V: X18.A10 X18.B10 X19.A10 X19.B10 X20.A10 X20.B10 ; also sheet 1,2,3,4,5
AGND: X18.A1 X18.A9 X18.A11 X18.A16 X18.A18 X18.A28 X18.A32 X18.B1 X18.B9 X18.B11 X18.B16 X18.B18 X18.B28 X18.B32 X19.A1 X19.A9 X19.A11 X19.A16 X19.A18 X19.A28 X19.A32 X19.B1 X19.B9 X19.B11 X19.B16 X19.B18 X19.B28 X19.B32 X20.A1 X20.A9 X20.A11 X20.A16 X20.A18 X20.A28 X20.A32 X20.B1 X20.B9 X20.B11 X20.B16 X20.B18 X20.B28 X20.B32 ; also sheet 1,2,3,4,5
AN0: X18.A29 X19.A29 X20.A29 ; also sheet 1,2,3,4,5
AN1: X18.B29 X19.B29 X20.B29 ; also sheet 1,2,3,4,5
AN2: X18.A30 X19.A30 X20.A30 ; also sheet 1,2,3,4,5
AN3: X18.B30 X19.B30 X20.B30 ; also sheet 1,2,3,4,5
AN4: X18.A31 X19.A31 X20.A31 ; also sheet 1,2,3,4,5
AN5: X18.B31 X19.B31 X20.B31 ; also sheet 1,2,3,4,5
GND: X18.A2 X18.A3 X18.A26 X18.B2 X18.B3 X18.B19 X18.B20 X18.B21 X18.B22 X18.B23 X18.B24 X18.B25 X18.B26 X19.A2 X19.A3 X19.A26 X19.B2 X19.B3 X19.B19 X19.B20 X19.B21 X19.B22 X19.B23 X19.B24 X19.B25 X19.B26 X20.A2 X20.A3 X20.A26 X20.B2 X20.B3 X20.B19 X20.B20 X20.B21 X20.B22 X20.B23 X20.B24 X20.B25 X20.B26 ; also sheet 1,2,3,4,5
GPIO0: X18.A5 X19.A5 X20.A5 ; also sheet 1,2,3,4,5
GPIO1: X18.B5 X19.B5 X20.B5 ; also sheet 1,2,3,4,5
GPIO2: X18.A6 X19.A6 X20.A6 ; also sheet 1,2,3,4,5
GPIO3: X18.B6 X19.B6 X20.B6 ; also sheet 1,2,3,4,5
GPIO4: X18.A7 X19.A7 X20.A7 ; also sheet 1,2,3,4,5
GPIO5: X18.B7 X19.B7 X20.B7 ; also sheet 1,2,3,4,5
GPIO6: X18.A8 X19.A8 X20.A8 ; also sheet 1,2,3,4,5
GPIO7: X18.B8 X19.B8 X20.B8 ; also sheet 1,2,3,4,5
GPIO8: X18.A12 X19.A12 X20.A12 ; also sheet 1,2,3,4,5
GPIO9: X18.B12 X19.B12 X20.B12 ; also sheet 1,2,3,4,5
GPIO10: X18.A13 X19.A13 X20.A13 ; also sheet 1,2,3,4,5
GPIO11: X18.B13 X19.B13 X20.B13 ; also sheet 1,2,3,4,5
GPIO12: X18.A14 X19.A14 X20.A14 ; also sheet 1,2,3,4,5
GPIO13: X18.B14 X19.B14 X20.B14 ; also sheet 1,2,3,4,5
GPIO14: X18.A15 X19.A15 X20.A15 ; also sheet 1,2,3,4,5
GPIO15: X18.B15 X19.B15 X20.B15 ; also sheet 1,2,3,4,5
I2C_CLK: X18.A22 X19.A22 X20.A22 ; also sheet 1,2,3,4,5
I2C_DAT: X18.A23 X19.A23 X20.A23 ; also sheet 1,2,3,4,5
SPI_CLK: X18.A19 X19.A19 X20.A19 ; also sheet 1,2,3,4,5
SPI_MISO: X18.A21 X19.A21 X20.A21 ; also sheet 1,2,3,4,5
SPI_MOSI: X18.A20 X19.A20 X20.A20 ; also sheet 1,2,3,4,5
UC_RX: X18.A25 X19.A25 X20.A25 ; also sheet 1,2,3,4,5
UC_TX: X18.A24 X19.A24 X20.A24 ; also sheet 1,2,3,4,5

## Library data of the parts
J1 J2 = con-faston:PIN2: Flachstecker Typ Tyco/Electronics/AMP TAB, FASTON Printed Circuit Board Tabs Source: http://www.buerklin.com, http://catalog.tycoelectronics.com; OC_FARNELL: unknown; OC_NEWARK: unknown
SJ1 = acrooptics:SJ: SMD solder JUMPER
X1 = noah:FAB64S: CONNECTOR female, 64 pins, block, type B, rows AB, grid 2.54 mm
X2-X20 = con-vg:FAB64S: CONNECTOR female, 64 pins, block, type B, rows AB, grid 2.54 mm

## Board
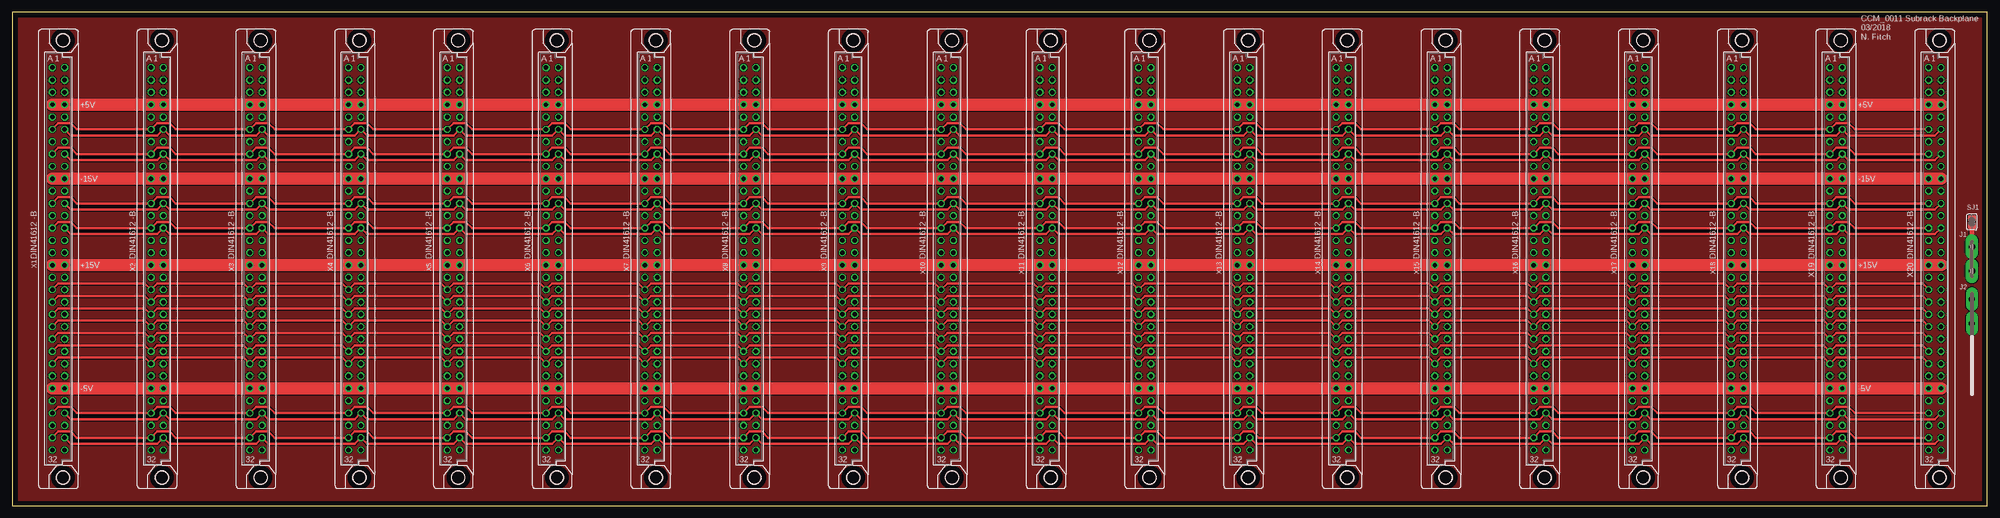
[diagram p6: board, top side]
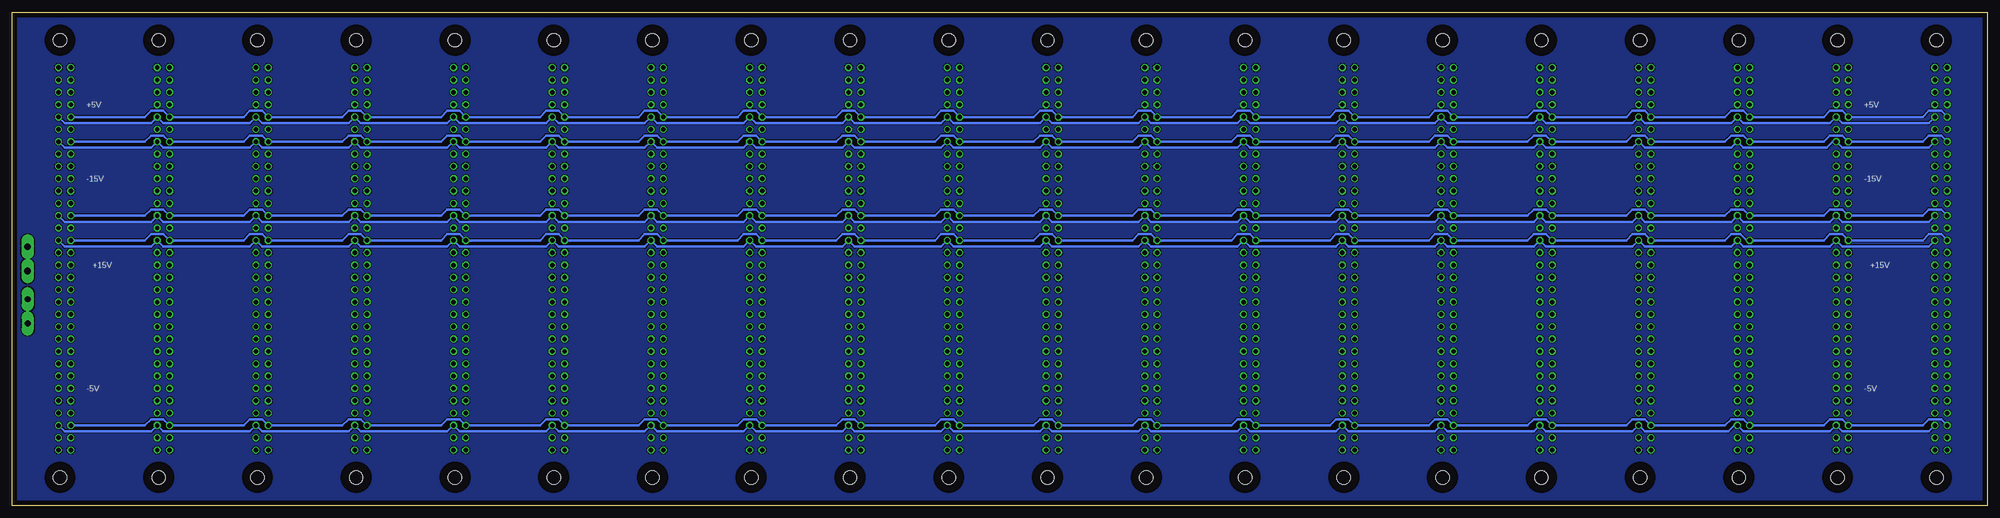
[diagram p7: board, bottom side, seen from below]

Size 406.4 x 101.6 mm. Coordinates in mm from the lower left corner, seen from the top.
Outline: 0,0 406.4,0 406.4,101.6 0,101.6 0,0
Copper layers (1*16): Top 0.035mm / dielectric 1.5mm / Bottom 0.035mm
Design rules "default *": minimum track width 6mil, minimum drill 0.35mm, track to track 6mil, track to pad 6mil, pad to pad 6mil, via to via 6mil, smd to smd 6mil, copper to edge 40mil, drill to drill 6mil, minimum pad ring 10mil, minimum via ring 8mil, stop-mask expansion 4mil, vias tented up to drill 0mil, thermal gap 10mil

### Footprints (pad centres in the part's own frame; a part is rotated, then mirrored left to right if it is on the bottom)
F061.100 = drill 1.4 pad 2.54 long: A1 -2.5,0; A2 2.5,0
F061.220 = drill 1.2 pad 2.5 long: 1A -2.5,0; 1B 2.5,0
SJ = smd 1.168 x 1.6: 1 -0.762,0; 2 0.762,0
FAB64S = drill 0.914 octagon: A1 -1.27,39.37; A2 -1.27,36.83; A3 -1.27,34.29; A4 -1.27,31.75; A5 -1.27,29.21; A6 -1.27,26.67; A7 -1.27,24.13; A8 -1.27,21.59; A9 -1.27,19.05; A10 -1.27,16.51; A11 -1.27,13.97; A12 -1.27,11.43; A13 -1.27,8.89; A14 -1.27,6.35; A15 -1.27,3.81; A16 -1.27,1.27; A17 -1.27,-1.27; A18 -1.27,-3.81; A19 -1.27,-6.35; A20 -1.27,-8.89; A21 -1.27,-11.43; A22 -1.27,-13.97; A23 -1.27,-16.51; A24 -1.27,-19.05; A25 -1.27,-21.59; A26 -1.27,-24.13; A27 -1.27,-26.67; A28 -1.27,-29.21; A29 -1.27,-31.75; A30 -1.27,-34.29; A31 -1.27,-36.83; A32 -1.27,-39.37; B1 1.27,39.37; B2 1.27,36.83; B3 1.27,34.29; B4 1.27,31.75; B5 1.27,29.21; B6 1.27,26.67; B7 1.27,24.13; B8 1.27,21.59; B9 1.27,19.05; B10 1.27,16.51; B11 1.27,13.97; B12 1.27,11.43; B13 1.27,8.89; B14 1.27,6.35; B15 1.27,3.81; B16 1.27,1.27; B17 1.27,-1.27; B18 1.27,-3.81; B19 1.27,-6.35; B20 1.27,-8.89; B21 1.27,-11.43; B22 1.27,-13.97; B23 1.27,-16.51; B24 1.27,-19.05; B25 1.27,-21.59; B26 1.27,-24.13; B27 1.27,-26.67; B28 1.27,-29.21; B29 1.27,-31.75; B30 1.27,-34.29; B31 1.27,-36.83; B32 1.27,-39.37 | hole 2.794: 0.965,-45.009; 0.965,45.009

### Placement (x,y rotation side)
J1  403.23,50.8 90 top
J2  403.23,40.01 270 top
SJ1  403.23,58.42 90 top
X1  9.53,50.8 0 top
X2  29.84,50.8 0 top
X3  50.16,50.8 0 top
X4  70.48,50.8 0 top
X5  90.81,50.8 0 top
X6  111.12,50.8 0 top
X7  131.44,50.8 0 top
X8  151.76,50.8 0 top
X9  172.09,50.8 0 top
X10  192.41,50.8 0 top
X11  212.72,50.8 0 top
X12  233.04,50.8 0 top
X13  253.37,50.8 0 top
X14  273.69,50.8 0 top
X15  294,50.8 0 top
X16  314.32,50.8 0 top
X17  334.64,50.8 0 top
X18  354.96,50.8 0 top
X19  375.29,50.8 0 top
X20  395.61,50.8 0 top

### Tracks (layer width: path | path; a pad name or v marks a point on that pad's centre or on a via)
+5V
  Top 2.54: X1.A4 X1.B4 X2.A4 X2.B4 X3.A4 X3.B4 X4.A4 X4.B4 X5.A4 X5.B4 X6.A4 X6.B4 X7.A4 X7.B4 X8.A4 X8.B4 X9.A4 X9.B4 X10.A4 X10.B4 X11.A4 X11.B4 X12.A4 X12.B4 X13.A4 X13.B4 X14.A4 X14.B4 X15.A4 X15.B4 X16.A4 X16.B4 X17.A4 X17.B4 X18.A4 X18.B4 X19.A4 X19.B4 X20.A4 X20.B4
+15V
  Top 2.54: X1.A17 X1.B17 X2.A17 X2.B17 X3.A17 X3.B17 X4.A17 X4.B17 X5.A17 X5.B17 X6.A17 X6.B17 X7.A17 X7.B17 X8.A17 X8.B17 X9.A17 X9.B17 X10.A17 X10.B17 X11.A17 X11.B17 X12.A17 X12.B17 X13.A17 X13.B17 X14.A17 X14.B17 X15.A17 X15.B17 X16.A17 X16.B17 X17.A17 X17.B17 X18.A17 X18.B17 X19.A17 X19.B17 X20.A17 X20.B17
-5V
  Top 2.54: X1.A27 X1.B27 X2.A27 X2.B27 X3.A27 X3.B27 X4.A27 X4.B27 X5.A27 X5.B27 X6.A27 X6.B27 X7.A27 X7.B27 X8.A27 X8.B27 X9.A27 X9.B27 X10.A27 X10.B27 X11.A27 X11.B27 X12.A27 X12.B27 X13.A27 X13.B27 X14.A27 X14.B27 X15.A27 X15.B27 X16.A27 X16.B27 X17.A27 X17.B27 X18.A27 X18.B27 X19.A27 X19.B27 X20.A27 X20.B27
-15V
  Top 2.54: X1.A10 X1.B10 X2.A10 X2.B10 X3.A10 X3.B10 X4.A10 X4.B10 X5.A10 X5.B10 X6.A10 X6.B10 X7.A10 X7.B10 X8.A10 X8.B10 X9.A10 X9.B10 X10.A10 X10.B10 X11.A10 X11.B10 X12.A10 X12.B10 X13.A10 X13.B10 X14.A10 X14.B10 X15.A10 X15.B10 X16.A10 X16.B10 X17.A10 X17.B10 X18.A10 X18.B10 X19.A10 X19.B10 X20.A10 X20.B10
AGND
  Top 1.016: SJ1.1 J1.A2
  pour Bottom: 0,0 0,101.6 406.4,101.6 406.4,0
AN0
  Top 0.508: X1.A29 9.53,20.32 12.06,20.32 13.34,19.05 X2.A29 29.84,20.32 32.38,20.32 33.66,19.05 X3.A29 50.16,20.32 52.7,20.32 53.98,19.05 X4.A29 70.48,20.32 73.03,20.32 74.3,19.05 X5.A29 90.81,20.32 93.34,20.32 94.61,19.05 X6.A29 111.12,20.32 113.67,20.32 114.94,19.05 X7.A29 131.44,20.32 133.99,20.32 135.25,19.05 X8.A29 151.76,20.32 154.31,20.32 155.57,19.05 X9.A29 172.09,20.32 174.62,20.32 175.9,19.05 X10.A29 192.41,20.32 194.94,20.32 196.22,19.05 X11.A29 212.72,20.32 215.26,20.32 216.53,19.05 X12.A29 233.04,20.32 235.59,20.32 236.85,19.05 X13.A29 253.37,20.32 255.91,20.32 257.18,19.05 X14.A29 273.69,20.32 276.23,20.32 277.5,19.05 X15.A29 294,20.32 296.55,20.32 297.81,19.05 X16.A29 314.32,20.32 316.87,20.32 318.13,19.05 X17.A29 334.64,20.32 337.19,20.32 338.45,19.05 X18.A29 354.96,20.32 357.5,20.32 358.77,19.05 X19.A29 375.29,20.32 377.82,20.32 379.1,19.05 X20.A29
AN1
  Top 0.508: X1.B29 12.06,17.78 29.84,17.78 X2.B29 32.38,17.78 50.16,17.78 X3.B29 52.7,17.78 70.48,17.78 X4.B29 73.03,17.78 90.81,17.78 X5.B29 93.34,17.78 111.12,17.78 X6.B29 113.67,17.78 131.44,17.78 X7.B29 133.99,17.78 151.76,17.78 X8.B29 154.31,17.78 172.09,17.78 X9.B29 174.62,17.78 192.41,17.78 X10.B29 194.94,17.78 212.72,17.78 X11.B29 215.26,17.78 233.04,17.78 X12.B29 235.59,17.78 253.37,17.78 X13.B29 255.91,17.78 273.69,17.78 X14.B29 276.23,17.78 294,17.78 X15.B29 296.55,17.78 314.32,17.78 X16.B29 316.87,17.78 334.64,17.78 X17.B29 337.19,17.78 354.96,17.78 X18.B29 357.5,17.78 375.29,17.78 X19.B29 377.82,17.78 395.61,17.78 X20.B29
AN2
  Bottom 0.508: X1.A30 9.53,17.78 12.06,17.78 13.34,16.51 X2.A30 29.84,17.78 32.38,17.78 33.66,16.51 X3.A30 50.16,17.78 52.7,17.78 53.98,16.51 X4.A30 70.48,17.78 73.03,17.78 74.3,16.51 X5.A30 90.81,17.78 93.34,17.78 94.61,16.51 X6.A30 111.12,17.78 113.67,17.78 114.94,16.51 X7.A30 131.44,17.78 133.99,17.78 135.25,16.51 X8.A30 151.76,17.78 154.31,17.78 155.57,16.51 X9.A30 172.09,17.78 174.62,17.78 175.9,16.51 X10.A30 192.41,17.78 194.94,17.78 196.22,16.51 X11.A30 212.72,17.78 215.26,17.78 216.53,16.51 X12.A30 233.04,17.78 235.59,17.78 236.85,16.51 X13.A30 253.37,17.78 255.91,17.78 257.18,16.51 X14.A30 273.69,17.78 276.23,17.78 277.5,16.51 X15.A30 294,17.78 296.55,17.78 297.81,16.51 X16.A30 314.32,17.78 316.87,17.78 318.13,16.51 X17.A30 334.64,17.78 337.19,17.78 338.45,16.51 X18.A30 354.96,17.78 357.5,17.78 358.77,16.51 X19.A30 375.29,17.78 377.82,17.78 379.1,16.51 X20.A30
AN3
  Bottom 0.508: X1.B30 12.06,15.24 29.84,15.24 X2.B30 32.38,15.24 50.16,15.24 X3.B30 52.07,16.51 53.34,15.24 70.48,15.24 X4.B30 73.03,15.24 90.81,15.24 X5.B30 93.34,15.24 111.12,15.24 X6.B30 113.67,15.24 131.44,15.24 X7.B30 133.99,15.24 151.76,15.24 X8.B30 154.31,15.24 172.09,15.24 X9.B30 174.62,15.24 192.41,15.24 X10.B30 194.94,15.24 212.72,15.24 X11.B30 215.26,15.24 233.04,15.24 X12.B30 235.59,15.24 253.37,15.24 X13.B30 255.91,15.24 273.69,15.24 X14.B30 276.23,15.24 294,15.24 X15.B30 296.55,15.24 314.32,15.24 X16.B30 316.87,15.24 334.64,15.24 X17.B30 337.19,15.24 354.96,15.24 X18.B30 357.5,15.24 375.29,15.24 X19.B30 377.82,15.24 395.61,15.24 X20.B30
AN4
  Top 0.508: X1.A31 9.53,15.24 12.06,15.24 13.34,13.97 X2.A31 29.84,15.24 32.38,15.24 33.66,13.97 X3.A31 50.16,15.24 52.7,15.24 53.98,13.97 X4.A31 70.48,15.24 73.03,15.24 74.3,13.97 X5.A31 90.81,15.24 93.34,15.24 94.61,13.97 X6.A31 111.12,15.24 113.67,15.24 114.94,13.97 X7.A31 131.44,15.24 133.99,15.24 135.25,13.97 X8.A31 151.76,15.24 154.31,15.24 155.57,13.97 X9.A31 172.09,15.24 174.62,15.24 175.9,13.97 X10.A31 192.41,15.24 194.94,15.24 196.22,13.97 X11.A31 212.72,15.24 215.26,15.24 216.53,13.97 X12.A31 233.04,15.24 235.59,15.24 236.85,13.97 X13.A31 253.37,15.24 255.27,15.24 256.54,13.97 X14.A31 273.69,15.24 276.23,15.24 277.5,13.97 X15.A31 294,15.24 296.55,15.24 297.81,13.97 X16.A31 314.32,15.24 316.87,15.24 318.13,13.97 X17.A31 334.64,15.24 337.19,15.24 338.45,13.97 X18.A31 354.96,15.24 357.5,15.24 358.77,13.97 X19.A31 375.29,15.24 377.82,15.24 379.1,13.97 X20.A31
AN5
  Top 0.508: X1.B31 12.06,12.7 29.84,12.7 X2.B31 32.38,12.7 50.16,12.7 X3.B31 52.7,12.7 70.48,12.7 X4.B31 73.03,12.7 90.81,12.7 X5.B31 93.34,12.7 111.12,12.7 X6.B31 113.67,12.7 131.44,12.7 X7.B31 133.99,12.7 151.76,12.7 X8.B31 154.31,12.7 172.09,12.7 X9.B31 174.62,12.7 192.41,12.7 X10.B31 194.94,12.7 212.72,12.7 X11.B31 215.26,12.7 233.04,12.7 X12.B31 235.59,12.7 253.37,12.7 X13.B31 255.91,12.7 273.69,12.7 X14.B31 276.23,12.7 294,12.7 X15.B31 296.55,12.7 314.32,12.7 X16.B31 316.87,12.7 334.64,12.7 X17.B31 337.19,12.7 354.96,12.7 X18.B31 357.5,12.7 375.29,12.7 X19.B31 377.82,12.7 395.61,12.7 X20.B31
GND
  pour Top: 0.64,0.64 0.64,100.97 405.76,100.97 405.76,0.64
GPIO0
  Bottom 0.508: X1.A5 9.53,81.28 12.06,81.28 13.34,80.01 X2.A5 29.84,81.28 32.38,81.28 33.66,80.01 X3.A5 50.16,81.28 52.7,81.28 53.98,80.01 X4.A5 70.48,81.28 73.03,81.28 74.3,80.01 X5.A5 90.81,81.28 93.34,81.28 94.61,80.01 X6.A5 111.12,81.28 113.67,81.28 114.94,80.01 X7.A5 131.44,81.28 133.99,81.28 135.25,80.01 X8.A5 151.76,81.28 154.31,81.28 155.57,80.01 X9.A5 172.09,81.28 174.62,81.28 175.9,80.01 X10.A5 192.41,81.28 194.94,81.28 196.22,80.01 X11.A5 212.72,81.28 215.26,81.28 216.53,80.01 X12.A5 233.04,81.28 235.59,81.28 236.85,80.01 X13.A5 253.37,81.28 255.91,81.28 257.18,80.01 X14.A5 273.69,81.28 276.23,81.28 277.5,80.01 X15.A5 294,81.28 296.55,81.28 297.81,80.01 X16.A5 314.32,81.28 316.87,81.28 318.13,80.01 X17.A5 334.64,81.28 337.19,81.28 338.45,80.01 X18.A5 354.96,81.28 357.5,81.28 358.77,80.01 X19.A5 375.29,81.28 377.82,81.28 379.1,80.01 X20.A5
GPIO1
  Bottom 0.508: X1.B5 12.06,78.74 29.84,78.74 X2.B5 32.38,78.74 50.16,78.74 X3.B5 52.7,78.74 70.48,78.74 X4.B5 73.03,78.74 90.81,78.74 X5.B5 93.34,78.74 111.12,78.74 X6.B5 113.67,78.74 131.44,78.74 X7.B5 133.99,78.74 151.76,78.74 X8.B5 154.31,78.74 172.09,78.74 X9.B5 174.62,78.74 192.41,78.74 X10.B5 194.94,78.74 212.72,78.74 X11.B5 215.26,78.74 233.04,78.74 X12.B5 235.59,78.74 253.37,78.74 X13.B5 255.91,78.74 273.69,78.74 X14.B5 276.23,78.74 294,78.74 X15.B5 296.55,78.74 314.32,78.74 X16.B5 316.87,78.74 334.64,78.74 X17.B5 337.19,78.74 354.96,78.74 X18.B5 357.5,78.74 375.29,78.74 X19.B5 377.82,78.74 395.61,78.74 X20.B5
GPIO2
  Top 0.508: X1.A6 9.53,78.74 12.06,78.74 13.34,77.47 X2.A6 29.84,78.74 32.38,78.74 33.66,77.47 X3.A6 50.16,78.74 52.7,78.74 53.98,77.47 X4.A6 70.48,78.74 73.03,78.74 74.3,77.47 X5.A6 90.81,78.74 93.34,78.74 94.61,77.47 X6.A6 111.12,78.74 113.67,78.74 114.94,77.47 X7.A6 131.44,78.74 133.99,78.74 135.25,77.47 X8.A6 151.76,78.74 154.31,78.74 155.57,77.47 X9.A6 172.09,78.74 174.62,78.74 175.9,77.47 X10.A6 192.41,78.74 194.94,78.74 196.22,77.47 X11.A6 212.72,78.74 215.26,78.74 216.53,77.47 X12.A6 233.04,78.74 235.59,78.74 236.85,77.47 X13.A6 253.37,78.74 255.91,78.74 257.18,77.47 X14.A6 273.69,78.74 276.23,78.74 277.5,77.47 X15.A6 294,78.74 296.55,78.74 297.81,77.47 X16.A6 314.32,78.74 316.87,78.74 318.13,77.47 X17.A6 334.64,78.74 337.19,78.74 338.45,77.47 X18.A6 354.96,78.74 357.5,78.74 358.77,77.47 X19.A6 375.29,78.74 377.82,78.74 379.1,77.47 X20.A6
GPIO3
  Top 0.508: X1.B6 12.06,76.2 29.84,76.2 X2.B6 32.38,76.2 50.16,76.2 X3.B6 52.7,76.2 70.48,76.2 X4.B6 73.03,76.2 90.81,76.2 X5.B6 93.34,76.2 111.12,76.2 X6.B6 113.67,76.2 131.44,76.2 X7.B6 133.99,76.2 151.76,76.2 X8.B6 154.31,76.2 172.09,76.2 X9.B6 174.62,76.2 192.41,76.2 X10.B6 194.94,76.2 212.72,76.2 X11.B6 215.26,76.2 233.04,76.2 X12.B6 235.59,76.2 253.37,76.2 X13.B6 255.91,76.2 273.69,76.2 X14.B6 276.23,76.2 294,76.2 X15.B6 296.55,76.2 314.32,76.2 X16.B6 316.87,76.2 334.64,76.2 X17.B6 337.19,76.2 354.96,76.2 X18.B6 357.5,76.2 375.29,76.2 X19.B6 377.82,76.2 395.61,76.2 X20.B6
GPIO4
  Bottom 0.508: X1.A7 9.53,76.2 12.06,76.2 13.34,74.93 X2.A7 29.84,76.2 32.38,76.2 33.66,74.93 X3.A7 50.16,76.2 52.7,76.2 53.98,74.93 X4.A7 70.48,76.2 73.03,76.2 74.3,74.93 X5.A7 90.81,76.2 93.34,76.2 94.61,74.93 X6.A7 111.12,76.2 113.67,76.2 114.94,74.93 X7.A7 131.44,76.2 133.99,76.2 135.25,74.93 X8.A7 151.76,76.2 154.31,76.2 155.57,74.93 X9.A7 172.09,76.2 174.62,76.2 175.9,74.93 X10.A7 192.41,76.2 194.94,76.2 196.22,74.93 X11.A7 212.72,76.2 215.26,76.2 216.53,74.93 X12.A7 233.04,76.2 235.59,76.2 236.85,74.93 X13.A7 253.37,76.2 255.91,76.2 257.18,74.93 X14.A7 273.69,76.2 276.23,76.2 277.5,74.93 X15.A7 294,76.2 296.55,76.2 297.81,74.93 X16.A7 314.32,76.2 316.87,76.2 318.13,74.93 X17.A7 334.64,76.2 337.19,76.2 338.45,74.93 X18.A7 354.96,76.2 357.5,76.2 358.77,74.93 X19.A7 375.29,76.2 377.82,76.2 379.1,74.93 X20.A7
GPIO5
  Bottom 0.508: X1.B7 12.06,73.66 29.84,73.66 X2.B7 31.75,74.93 33.02,73.66 50.16,73.66 X3.B7 52.7,73.66 70.48,73.66 X4.B7 73.03,73.66 90.81,73.66 X5.B7 93.34,73.66 111.12,73.66 X6.B7 113.67,73.66 131.44,73.66 X7.B7 133.99,73.66 151.76,73.66 X8.B7 154.31,73.66 172.09,73.66 X9.B7 174.62,73.66 192.41,73.66 X10.B7 194.94,73.66 212.72,73.66 X11.B7 215.26,73.66 233.04,73.66 X12.B7 235.59,73.66 253.37,73.66 X13.B7 255.91,73.66 273.69,73.66 X14.B7 276.23,73.66 294,73.66 X15.B7 296.55,73.66 314.32,73.66 X16.B7 316.87,73.66 334.64,73.66 X17.B7 337.19,73.66 354.96,73.66 X18.B7 357.5,73.66 375.29,73.66 X19.B7 377.82,73.66 395.61,73.66 X20.B7
GPIO6
  Top 0.508: X1.A8 9.53,73.66 12.06,73.66 13.34,72.39 X2.A8 29.84,73.66 32.38,73.66 33.66,72.39 X3.A8 50.16,73.66 52.7,73.66 53.98,72.39 X4.A8 70.48,73.66 73.03,73.66 74.3,72.39 X5.A8 90.81,73.66 93.34,73.66 94.61,72.39 X6.A8 111.12,73.66 113.67,73.66 114.94,72.39 X7.A8 131.44,73.66 133.99,73.66 135.25,72.39 X8.A8 151.76,73.66 154.31,73.66 155.57,72.39 X9.A8 172.09,73.66 174.62,73.66 175.9,72.39 X10.A8 192.41,73.66 194.94,73.66 196.22,72.39 X11.A8 212.72,73.66 215.26,73.66 216.53,72.39 X12.A8 233.04,73.66 235.59,73.66 236.85,72.39 X13.A8 253.37,73.66 255.91,73.66 257.18,72.39 X14.A8 273.69,73.66 276.23,73.66 277.5,72.39 X15.A8 294,73.66 296.55,73.66 297.81,72.39 X16.A8 314.32,73.66 316.87,73.66 318.13,72.39 X17.A8 334.64,73.66 337.19,73.66 338.45,72.39 X18.A8 354.96,73.66 357.5,73.66 358.77,72.39 X19.A8 375.29,73.66 377.82,73.66 379.1,72.39 X20.A8
GPIO7
  Top 0.508: X1.B8 12.06,71.12 29.84,71.12 X2.B8 32.38,71.12 50.16,71.12 X3.B8 52.7,71.12 70.48,71.12 X4.B8 73.03,71.12 90.81,71.12 X5.B8 93.34,71.12 111.12,71.12 X6.B8 113.67,71.12 131.44,71.12 X7.B8 133.99,71.12 151.76,71.12 X8.B8 154.31,71.12 172.09,71.12 X9.B8 174.62,71.12 192.41,71.12 X10.B8 194.94,71.12 212.72,71.12 X11.B8 215.26,71.12 233.04,71.12 X12.B8 235.59,71.12 253.37,71.12 X13.B8 255.91,71.12 273.69,71.12 X14.B8 276.23,71.12 294,71.12 X15.B8 296.55,71.12 314.32,71.12 X16.B8 316.87,71.12 334.64,71.12 X17.B8 337.19,71.12 354.96,71.12 X18.B8 357.5,71.12 375.29,71.12 X19.B8 377.82,71.12 395.61,71.12 X20.B8
GPIO8
  Top 0.508: X1.A12 9.53,63.5 12.06,63.5 13.34,62.23 X2.A12 29.84,63.5 32.38,63.5 33.66,62.23 X3.A12 50.16,63.5 52.7,63.5 53.98,62.23 X4.A12 70.48,63.5 73.03,63.5 74.3,62.23 X5.A12 90.81,63.5 93.34,63.5 94.61,62.23 X6.A12 111.12,63.5 113.67,63.5 114.94,62.23 X7.A12 131.44,63.5 133.99,63.5 135.25,62.23 X8.A12 151.76,63.5 154.31,63.5 155.57,62.23 X9.A12 172.09,63.5 174.62,63.5 175.9,62.23 X10.A12 192.41,63.5 194.94,63.5 196.22,62.23 X11.A12 212.72,63.5 215.26,63.5 216.53,62.23 X12.A12 233.04,63.5 235.59,63.5 236.85,62.23 X13.A12 253.37,63.5 255.91,63.5 257.18,62.23 X14.A12 273.69,63.5 276.23,63.5 277.5,62.23 X15.A12 294,63.5 296.55,63.5 297.81,62.23 X16.A12 314.32,63.5 316.87,63.5 318.13,62.23 X17.A12 334.64,63.5 337.19,63.5 338.45,62.23 X18.A12 354.96,63.5 357.5,63.5 358.77,62.23 X19.A12 375.29,63.5 377.82,63.5 379.1,62.23 X20.A12
GPIO9
  Top 0.508: X1.B12 12.06,60.96 29.84,60.96 X2.B12 32.38,60.96 50.16,60.96 X3.B12 52.7,60.96 70.48,60.96 X4.B12 73.03,60.96 90.81,60.96 X5.B12 93.34,60.96 111.12,60.96 X6.B12 113.67,60.96 131.44,60.96 X7.B12 133.99,60.96 151.76,60.96 X8.B12 154.31,60.96 172.09,60.96 X9.B12 174.62,60.96 192.41,60.96 X10.B12 194.94,60.96 212.72,60.96 X11.B12 215.26,60.96 233.04,60.96 X12.B12 235.59,60.96 253.37,60.96 X13.B12 255.91,60.96 273.69,60.96 X14.B12 276.23,60.96 294,60.96 X15.B12 296.55,60.96 314.32,60.96 X16.B12 316.87,60.96 334.64,60.96 X17.B12 337.19,60.96 354.96,60.96 X18.B12 357.5,60.96 375.29,60.96 X19.B12 377.82,60.96 395.61,60.96 X20.B12
GPIO10
  Bottom 0.508: X1.A13 9.53,60.96 12.06,60.96 13.34,59.69 X2.A13 29.84,60.96 32.38,60.96 33.66,59.69 X3.A13 50.16,60.96 52.7,60.96 53.98,59.69 X4.A13 70.48,60.96 73.03,60.96 74.3,59.69 X5.A13 90.81,60.96 93.34,60.96 94.61,59.69 X6.A13 111.12,60.96 113.67,60.96 114.94,59.69 X7.A13 131.44,60.96 133.99,60.96 135.25,59.69 X8.A13 151.76,60.96 154.31,60.96 155.57,59.69 X9.A13 172.09,60.96 174.62,60.96 175.9,59.69 X10.A13 192.41,60.96 194.94,60.96 196.22,59.69 X11.A13 212.72,60.96 215.26,60.96 216.53,59.69 X12.A13 233.04,60.96 235.59,60.96 236.85,59.69 X13.A13 253.37,60.96 255.91,60.96 257.18,59.69 X14.A13 273.69,60.96 276.23,60.96 277.5,59.69 X15.A13 294,60.96 296.55,60.96 297.81,59.69 X16.A13 314.32,60.96 316.87,60.96 318.13,59.69 X17.A13 334.64,60.96 337.19,60.96 338.45,59.69 X18.A13 354.96,60.96 357.5,60.96 358.77,59.69 X19.A13 375.29,60.96 377.82,60.96 379.1,59.69 X20.A13
GPIO11
  Bottom 0.508: X1.B13 12.06,58.42 29.84,58.42 X2.B13 32.38,58.42 50.16,58.42 X3.B13 52.7,58.42 70.48,58.42 X4.B13 73.03,58.42 90.81,58.42 X5.B13 93.34,58.42 111.12,58.42 X6.B13 113.67,58.42 131.44,58.42 X7.B13 133.99,58.42 151.76,58.42 X8.B13 154.31,58.42 172.09,58.42 X9.B13 174.62,58.42 192.41,58.42 X10.B13 194.94,58.42 212.72,58.42 X11.B13 215.26,58.42 233.04,58.42 X12.B13 235.59,58.42 253.37,58.42 X13.B13 255.91,58.42 273.69,58.42 X14.B13 276.23,58.42 294,58.42 X15.B13 296.55,58.42 314.32,58.42 X16.B13 316.87,58.42 334.64,58.42 X17.B13 337.19,58.42 354.96,58.42 X18.B13 357.5,58.42 375.29,58.42 X19.B13 377.82,58.42 395.61,58.42 X20.B13
GPIO12
  Top 0.508: X1.A14 9.53,58.42 12.06,58.42 13.34,57.15 X2.A14 29.84,58.42 32.38,58.42 33.66,57.15 X3.A14 50.16,58.42 52.7,58.42 53.98,57.15 X4.A14 70.48,58.42 73.03,58.42 74.3,57.15 X5.A14 90.81,58.42 93.34,58.42 94.61,57.15 X6.A14 111.12,58.42 113.67,58.42 114.94,57.15 X7.A14 131.44,58.42 133.99,58.42 135.25,57.15 X8.A14 151.76,58.42 154.31,58.42 155.57,57.15 X9.A14 172.09,58.42 174.62,58.42 175.9,57.15 X10.A14 192.41,58.42 194.94,58.42 196.22,57.15 X11.A14 212.72,58.42 215.26,58.42 216.53,57.15 X12.A14 233.04,58.42 235.59,58.42 236.85,57.15 X13.A14 253.37,58.42 255.91,58.42 257.18,57.15 X14.A14 273.69,58.42 276.23,58.42 277.5,57.15 X15.A14 294,58.42 296.55,58.42 297.81,57.15 X16.A14 314.32,58.42 316.87,58.42 318.13,57.15 X17.A14 334.64,58.42 337.19,58.42 338.45,57.15 X18.A14 354.96,58.42 357.5,58.42 358.77,57.15 X19.A14 375.29,58.42 377.82,58.42 379.1,57.15 X20.A14
GPIO13
  Top 0.508: X1.B14 12.06,55.88 29.84,55.88 X2.B14 32.38,55.88 50.16,55.88 X3.B14 52.7,55.88 70.48,55.88 X4.B14 73.03,55.88 90.81,55.88 X5.B14 93.34,55.88 111.12,55.88 X6.B14 113.67,55.88 131.44,55.88 X7.B14 133.99,55.88 151.76,55.88 X8.B14 154.31,55.88 172.09,55.88 X9.B14 174.62,55.88 192.41,55.88 X10.B14 194.94,55.88 212.72,55.88 X11.B14 215.26,55.88 233.04,55.88 X12.B14 235.59,55.88 253.37,55.88 X13.B14 255.91,55.88 273.69,55.88 X14.B14 276.23,55.88 294,55.88 X15.B14 296.55,55.88 314.32,55.88 X16.B14 316.87,55.88 334.64,55.88 X17.B14 337.19,55.88 354.96,55.88 X18.B14 357.5,55.88 375.29,55.88 X19.B14 377.82,55.88 395.61,55.88 X20.B14
GPIO14
  Bottom 0.508: X1.A15 9.53,55.88 12.06,55.88 13.34,54.61 X2.A15 29.84,55.88 32.38,55.88 33.66,54.61 X3.A15 49.53,54.61 50.8,55.88 52.7,55.88 53.98,54.61 X4.A15 70.48,55.88 73.03,55.88 74.3,54.61 X5.A15 90.81,55.88 93.34,55.88 94.61,54.61 X6.A15 111.12,55.88 113.67,55.88 114.94,54.61 X7.A15 131.44,55.88 133.99,55.88 135.25,54.61 X8.A15 151.76,55.88 154.31,55.88 155.57,54.61 X9.A15 172.09,55.88 174.62,55.88 175.9,54.61 X10.A15 192.41,55.88 194.94,55.88 196.22,54.61 X11.A15 212.72,55.88 215.26,55.88 216.53,54.61 X12.A15 233.04,55.88 235.59,55.88 236.85,54.61 X13.A15 253.37,55.88 255.91,55.88 257.18,54.61 X14.A15 273.69,55.88 276.23,55.88 277.5,54.61 X15.A15 294,55.88 296.55,55.88 297.81,54.61 X16.A15 314.32,55.88 316.87,55.88 318.13,54.61 X17.A15 334.64,55.88 337.19,55.88 338.45,54.61 X18.A15 354.96,55.88 357.5,55.88 358.77,54.61 X19.A15 375.29,55.88 377.82,55.88 379.1,54.61 X20.A15
GPIO15
  Bottom 0.508: X1.B15 12.06,53.34 29.84,53.34 X2.B15 32.38,53.34 50.16,53.34 X3.B15 52.7,53.34 70.48,53.34 X4.B15 73.03,53.34 90.81,53.34 X5.B15 93.34,53.34 111.12,53.34 X6.B15 113.67,53.34 131.44,53.34 X7.B15 133.99,53.34 151.76,53.34 X8.B15 154.31,53.34 172.09,53.34 X9.B15 174.62,53.34 192.41,53.34 X10.B15 194.94,53.34 212.72,53.34 X11.B15 215.26,53.34 233.04,53.34 X12.B15 235.59,53.34 253.37,53.34 X13.B15 255.91,53.34 273.69,53.34 X14.B15 276.23,53.34 294,53.34 X15.B15 296.55,53.34 314.32,53.34 X16.B15 316.87,53.34 334.64,53.34 X17.B15 337.19,53.34 354.96,53.34 X18.B15 357.5,53.34 375.29,53.34 X19.B15 377.82,53.34 395.61,53.34 X20.B15
I2C_CLK
  Top 0.508: X1.A22 9.53,38.1 27.3,38.1 X2.A22 29.84,38.1 47.62,38.1 X3.A22 50.16,38.1 67.94,38.1 X4.A22 70.48,38.1 88.27,38.1 X5.A22 90.81,38.1 108.58,38.1 X6.A22 111.12,38.1 128.91,38.1 X7.A22 131.44,38.1 149.22,38.1 X8.A22 151.76,38.1 169.54,38.1 X9.A22 172.09,38.1 189.87,38.1 X10.A22 192.41,38.1 210.19,38.1 X11.A22 212.72,38.1 230.5,38.1 X12.A22 233.04,38.1 250.82,38.1 X13.A22 253.37,38.1 271.14,38.1 X14.A22 273.69,38.1 291.46,38.1 X15.A22 294,38.1 311.79,38.1 X16.A22 314.32,38.1 332.11,38.1 X17.A22 334.64,38.1 352.43,38.1 X18.A22 354.96,38.1 372.75,38.1 X19.A22 375.29,38.1 393.06,38.1 X20.A22
I2C_DAT
  Top 0.508: X1.A23 9.53,35.56 27.3,35.56 X2.A23 29.84,35.56 47.62,35.56 X3.A23 50.16,35.56 67.94,35.56 X4.A23 70.48,35.56 88.27,35.56 X5.A23 90.81,35.56 108.58,35.56 X6.A23 111.12,35.56 128.91,35.56 X7.A23 131.44,35.56 149.22,35.56 X8.A23 151.76,35.56 169.54,35.56 X9.A23 172.09,35.56 189.87,35.56 X10.A23 192.41,35.56 210.19,35.56 X11.A23 212.72,35.56 230.5,35.56 X12.A23 233.04,35.56 250.82,35.56 X13.A23 253.37,35.56 271.14,35.56 X14.A23 273.69,35.56 291.46,35.56 X15.A23 294,35.56 311.79,35.56 X16.A23 314.32,35.56 332.11,35.56 X17.A23 334.64,35.56 352.43,35.56 X18.A23 354.96,35.56 372.75,35.56 X19.A23 375.29,35.56 393.06,35.56 X20.A23
SPI_CLK
  Top 0.508: X1.A19 9.53,45.72 27.3,45.72 X2.A19 29.84,45.72 47.62,45.72 X3.A19 50.16,45.72 67.94,45.72 X4.A19 70.48,45.72 88.27,45.72 X5.A19 90.81,45.72 108.58,45.72 X6.A19 111.12,45.72 128.91,45.72 X7.A19 131.44,45.72 149.22,45.72 X8.A19 151.76,45.72 169.54,45.72 X9.A19 172.09,45.72 189.87,45.72 X10.A19 192.41,45.72 210.19,45.72 X11.A19 212.72,45.72 230.5,45.72 X12.A19 233.04,45.72 250.82,45.72 X13.A19 253.37,45.72 271.14,45.72 X14.A19 273.69,45.72 291.46,45.72 X15.A19 294,45.72 311.79,45.72 X16.A19 314.32,45.72 332.11,45.72 X17.A19 334.64,45.72 352.43,45.72 X18.A19 354.96,45.72 372.75,45.72 X19.A19 375.29,45.72 393.06,45.72 X20.A19
SPI_MISO
  Top 0.508: X1.A21 9.53,40.64 27.3,40.64 X2.A21 29.84,40.64 47.62,40.64 X3.A21 50.16,40.64 67.94,40.64 X4.A21 70.48,40.64 88.27,40.64 X5.A21 90.81,40.64 108.58,40.64 X6.A21 111.12,40.64 128.91,40.64 X7.A21 131.44,40.64 149.22,40.64 X8.A21 151.76,40.64 169.54,40.64 X9.A21 172.09,40.64 189.87,40.64 X10.A21 192.41,40.64 210.19,40.64 X11.A21 212.72,40.64 230.5,40.64 X12.A21 233.04,40.64 250.82,40.64 X13.A21 253.37,40.64 271.14,40.64 X14.A21 273.69,40.64 291.46,40.64 X15.A21 294,40.64 311.79,40.64 X16.A21 314.32,40.64 332.11,40.64 X17.A21 334.64,40.64 352.43,40.64 X18.A21 354.96,40.64 372.75,40.64 X19.A21 375.29,40.64 393.06,40.64 X20.A21
SPI_MOSI
  Top 0.508: X1.A20 9.53,43.18 27.3,43.18 X2.A20 29.84,43.18 47.62,43.18 X3.A20 50.16,43.18 67.94,43.18 X4.A20 70.48,43.18 88.27,43.18 X5.A20 90.81,43.18 108.58,43.18 X6.A20 111.12,43.18 128.91,43.18 X7.A20 131.44,43.18 149.22,43.18 X8.A20 151.76,43.18 169.54,43.18 X9.A20 172.09,43.18 189.87,43.18 X10.A20 192.41,43.18 210.19,43.18 X11.A20 212.72,43.18 230.5,43.18 X12.A20 233.04,43.18 250.82,43.18 X13.A20 253.37,43.18 271.14,43.18 X14.A20 273.69,43.18 291.46,43.18 X15.A20 294,43.18 311.79,43.18 X16.A20 314.32,43.18 332.11,43.18 X17.A20 334.64,43.18 352.43,43.18 X18.A20 354.96,43.18 372.75,43.18 X19.A20 375.29,43.18 393.06,43.18 X20.A20
UC_RX
  Top 0.508: X1.A25 9.53,30.48 27.3,30.48 X2.A25 29.84,30.48 47.62,30.48 X3.A25 50.16,30.48 67.94,30.48 X4.A25 70.48,30.48 88.27,30.48 X5.A25 90.81,30.48 108.58,30.48 X6.A25 111.12,30.48 128.91,30.48 X7.A25 131.44,30.48 149.22,30.48 X8.A25 151.76,30.48 169.54,30.48 X9.A25 172.09,30.48 189.87,30.48 X10.A25 192.41,30.48 210.19,30.48 X11.A25 212.72,30.48 230.5,30.48 X12.A25 233.04,30.48 250.82,30.48 X13.A25 253.37,30.48 271.14,30.48 X14.A25 273.69,30.48 291.46,30.48 X15.A25 294,30.48 311.79,30.48 X16.A25 314.32,30.48 332.11,30.48 X17.A25 334.64,30.48 352.43,30.48 X18.A25 354.96,30.48 372.75,30.48 X19.A25 375.29,30.48 393.06,30.48 X20.A25
UC_TX
  Top 0.508: X1.A24 9.53,33.02 27.3,33.02 X2.A24 29.84,33.02 47.62,33.02 X3.A24 50.16,33.02 67.94,33.02 X4.A24 70.48,33.02 88.27,33.02 X5.A24 90.81,33.02 108.58,33.02 X6.A24 111.12,33.02 128.91,33.02 X7.A24 131.44,33.02 149.22,33.02 X8.A24 151.76,33.02 169.54,33.02 X9.A24 172.09,33.02 189.87,33.02 X10.A24 192.41,33.02 210.19,33.02 X11.A24 212.72,33.02 230.5,33.02 X12.A24 233.04,33.02 250.82,33.02 X13.A24 253.37,33.02 271.14,33.02 X14.A24 273.69,33.02 291.46,33.02 X15.A24 294,33.02 311.79,33.02 X16.A24 314.32,33.02 332.11,33.02 X17.A24 334.64,33.02 352.43,33.02 X18.A24 354.96,33.02 372.75,33.02 X19.A24 375.29,33.02 393.06,33.02 X20.A24

### Text on the board
tNames: CCM_0011 Subrack Backplane / 03/2018 / N. Fitch | +5V | +5V | -15V | -15V | +15V | +15V | -5V | -5V
bNames: +5V | +5V | -15V | -15V | +15V | +15V | -5V | -5V